# Altium schematic sheet 0169_IMVP VREG _SOC__ C.SchDoc
size 848 x 543 mm
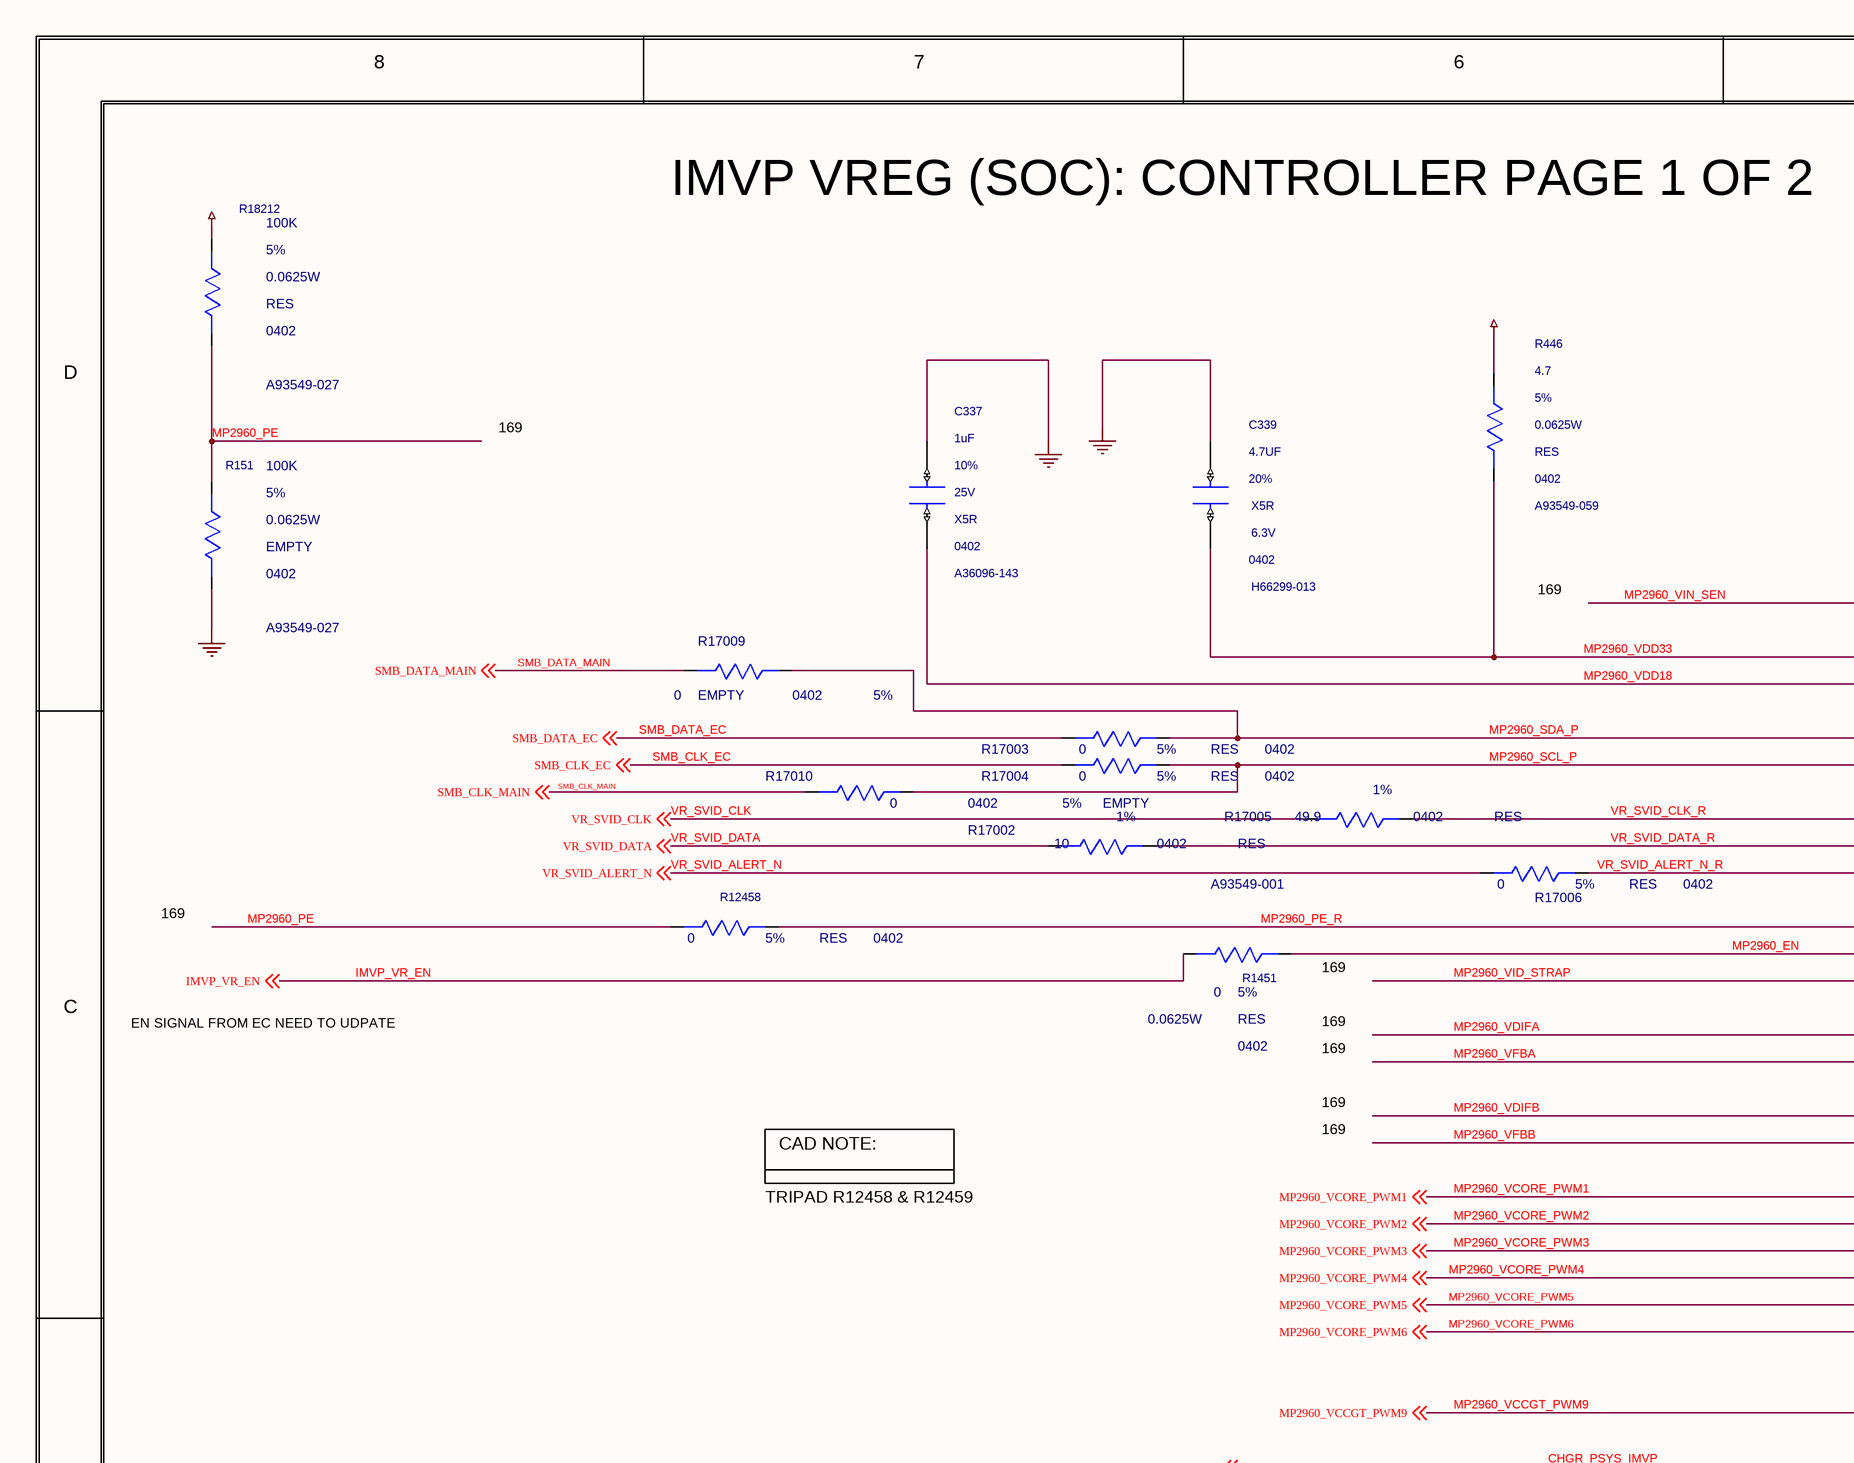
[diagram p0: 0169_IMVP VREG _SOC__ C.SchDoc, top left]
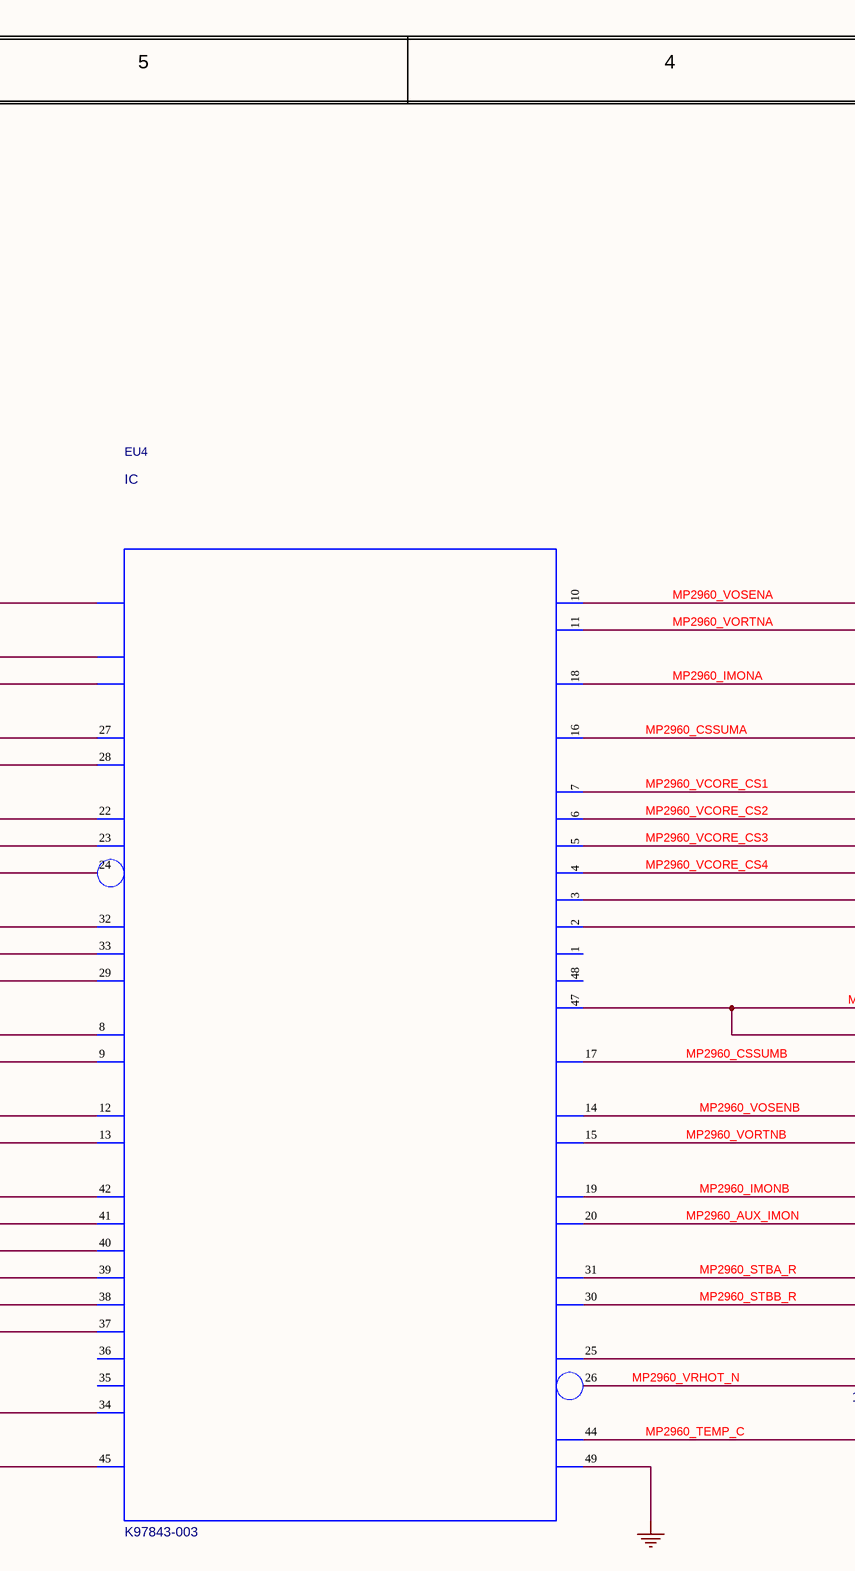
[diagram p1: 0169_IMVP VREG _SOC__ C.SchDoc, top middle]
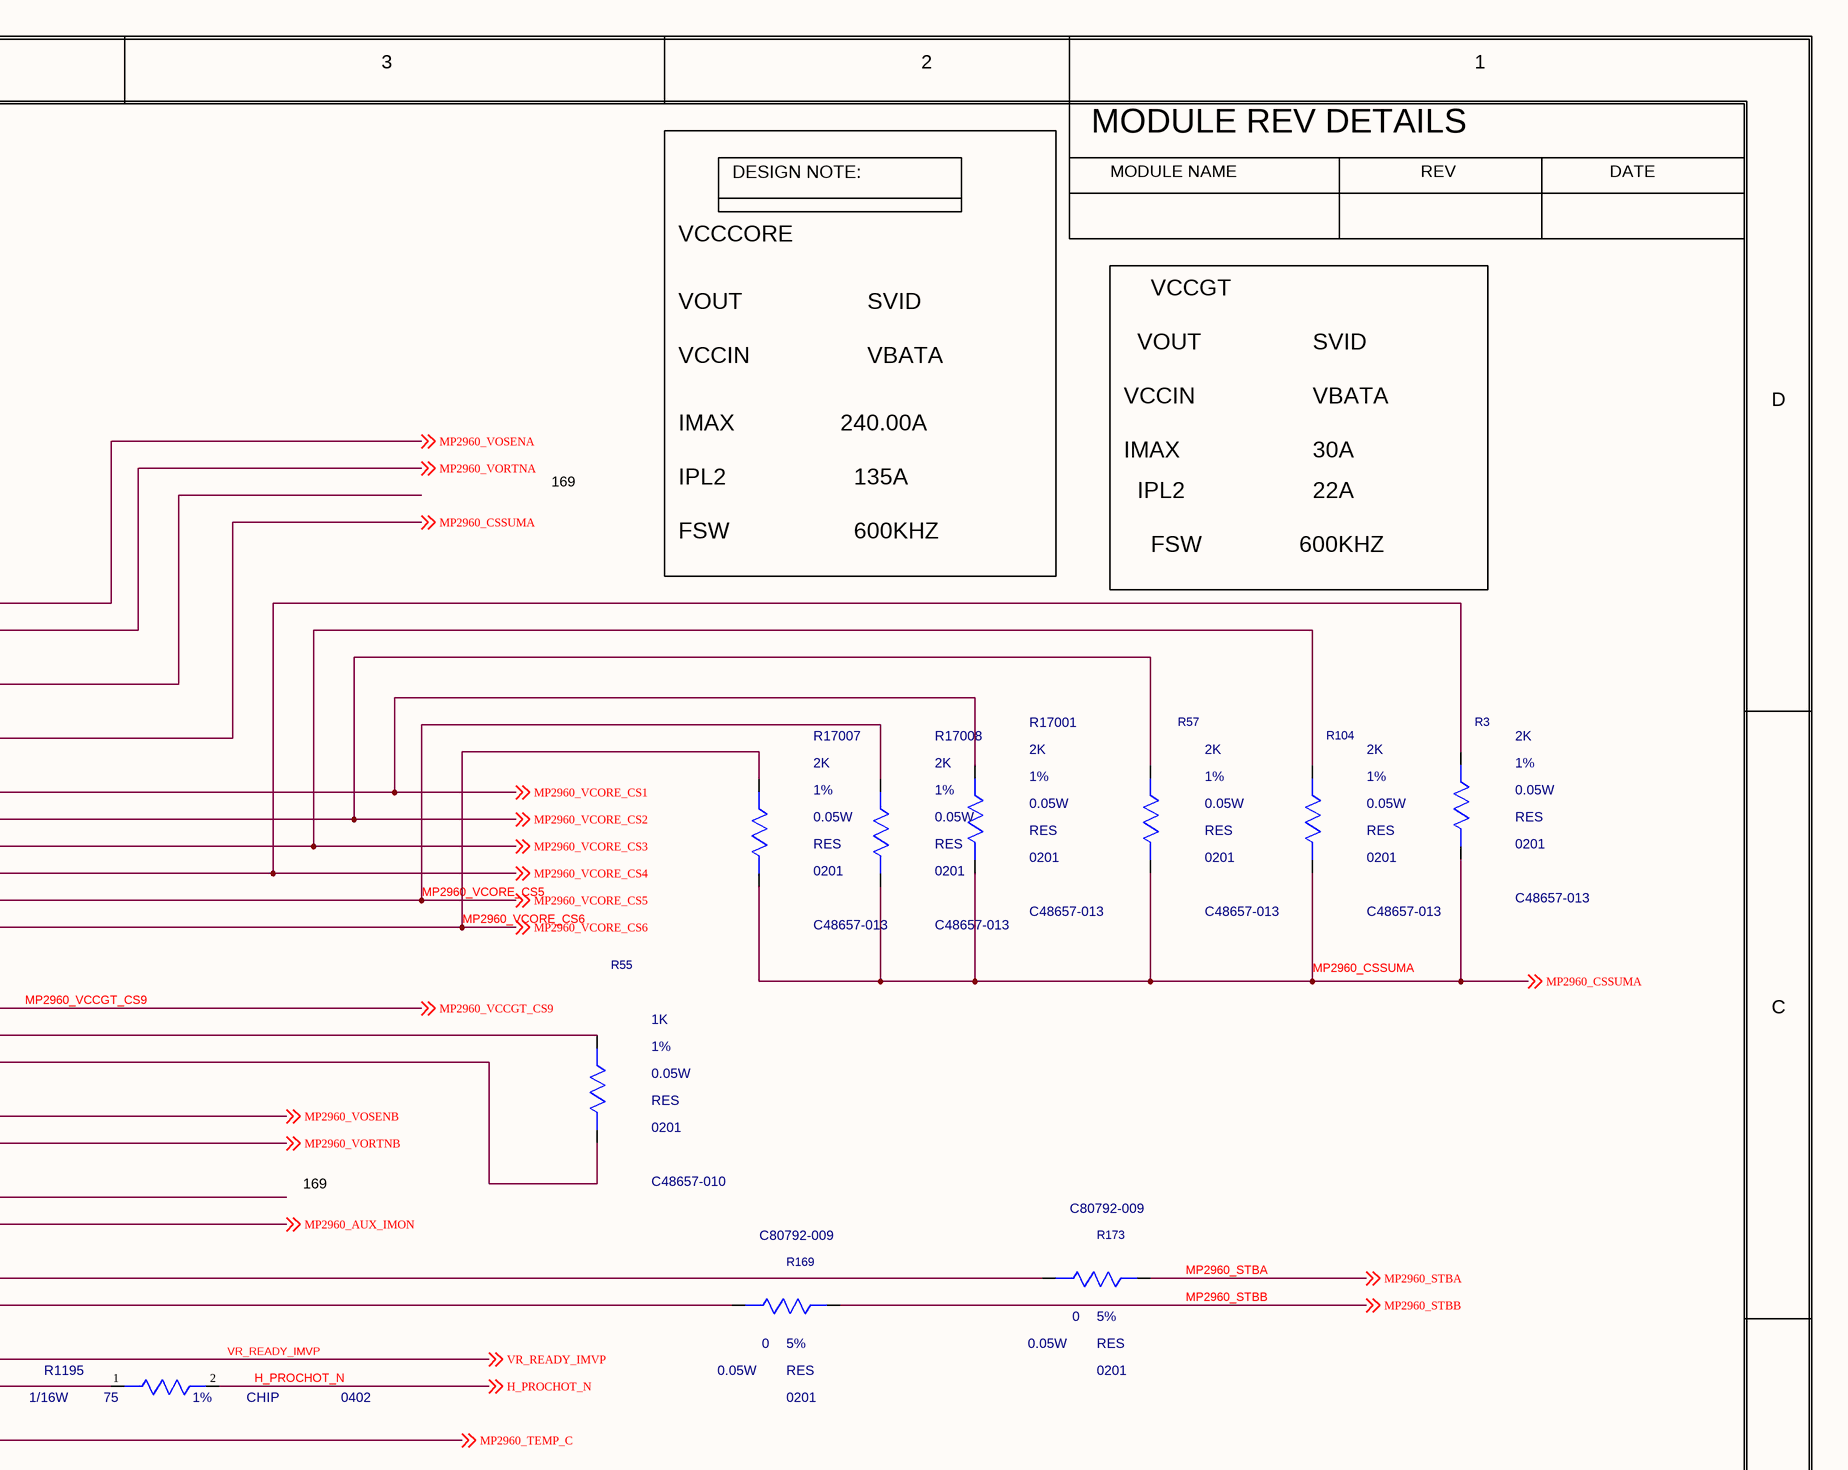
[diagram p2: 0169_IMVP VREG _SOC__ C.SchDoc, top right]
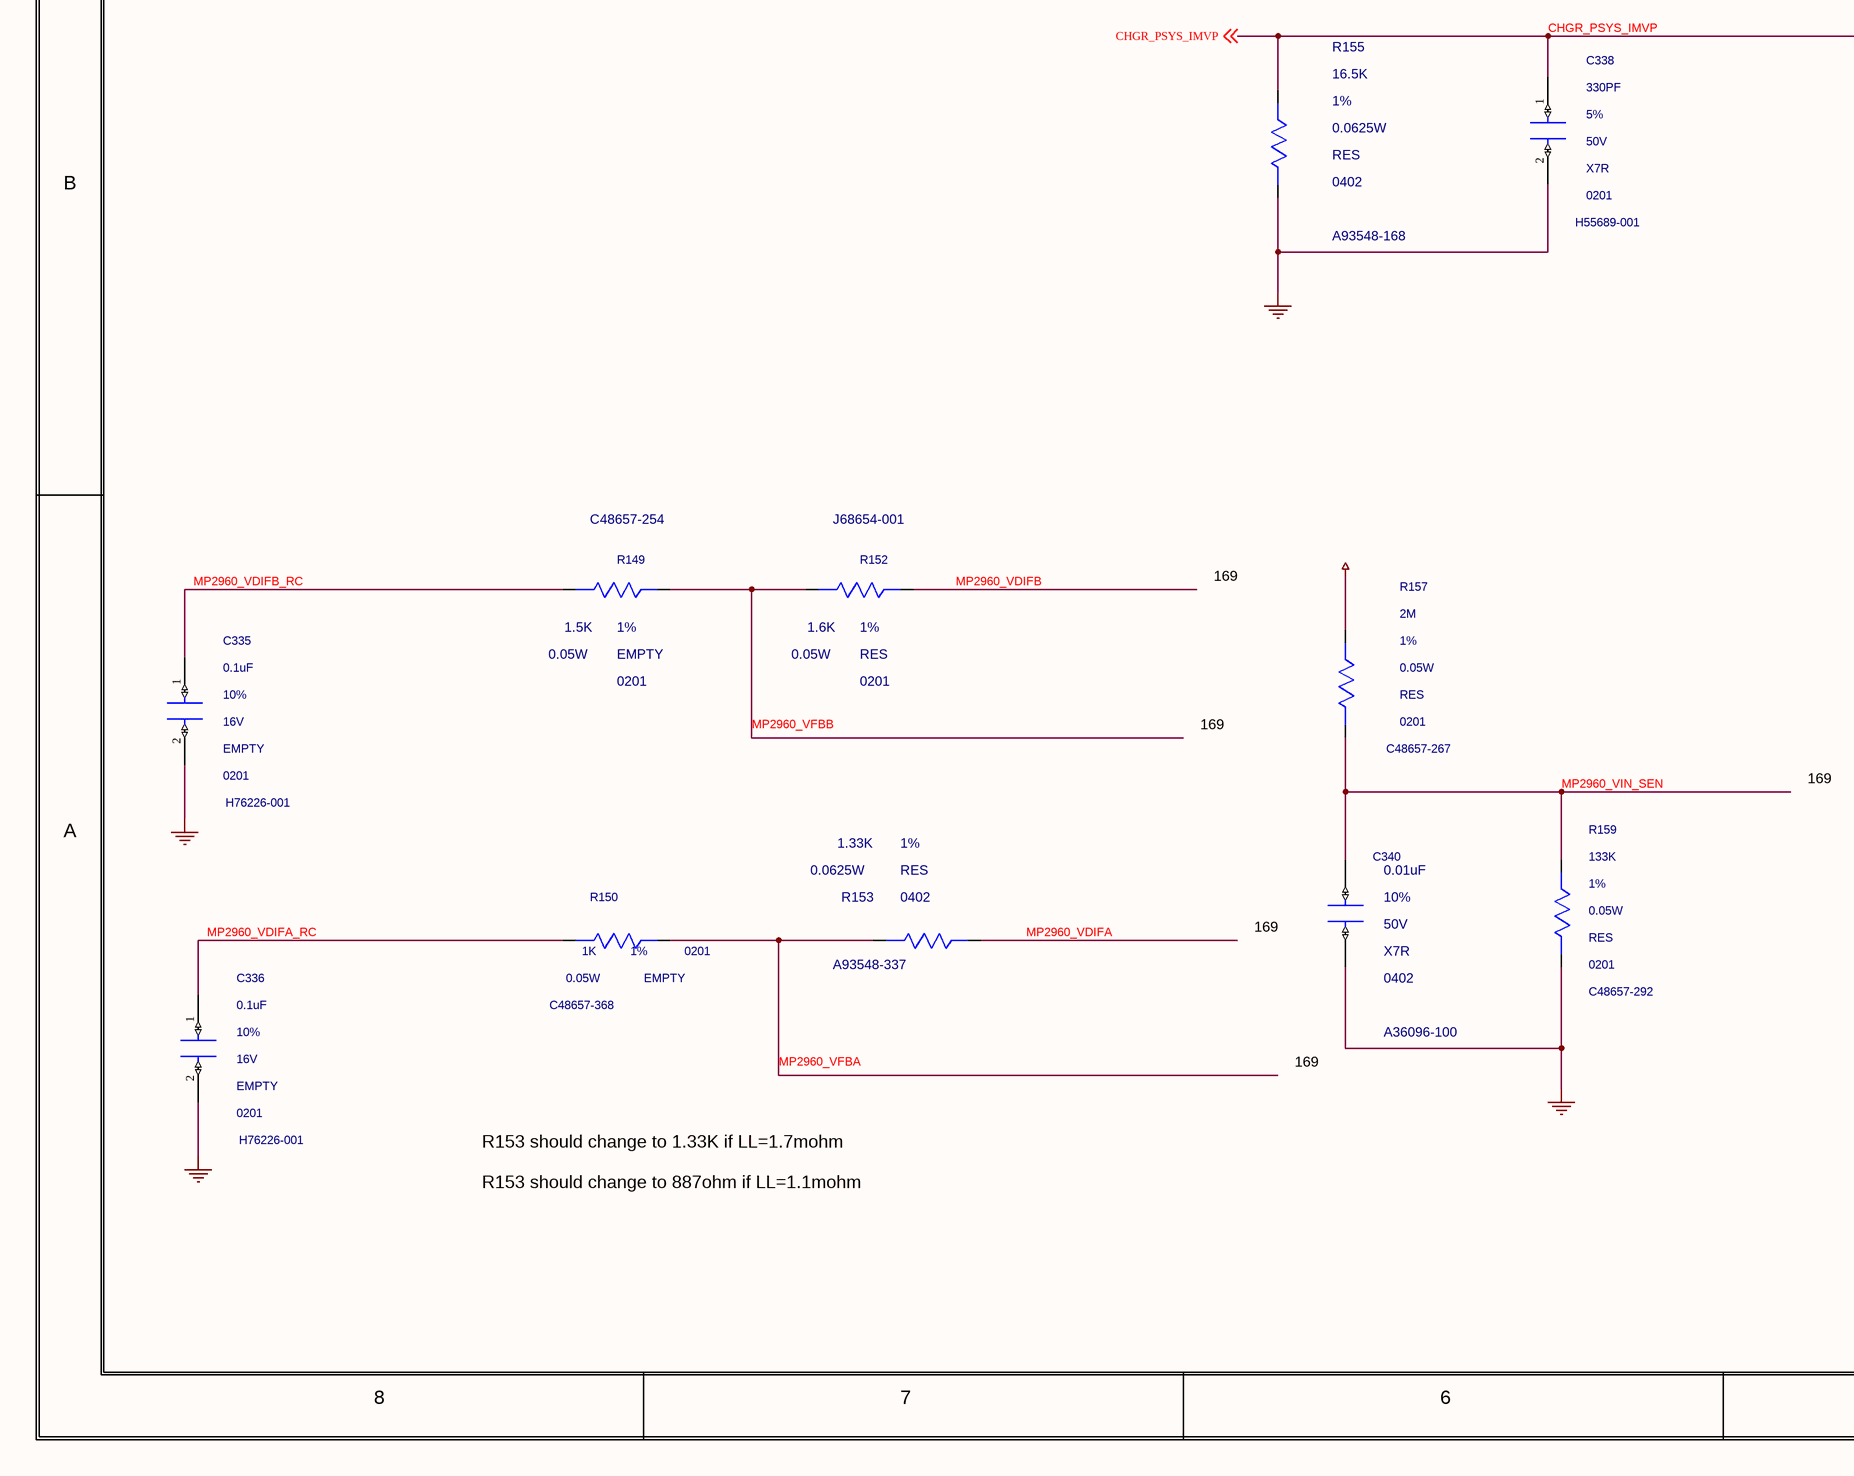
[diagram p3: 0169_IMVP VREG _SOC__ C.SchDoc, bottom left]
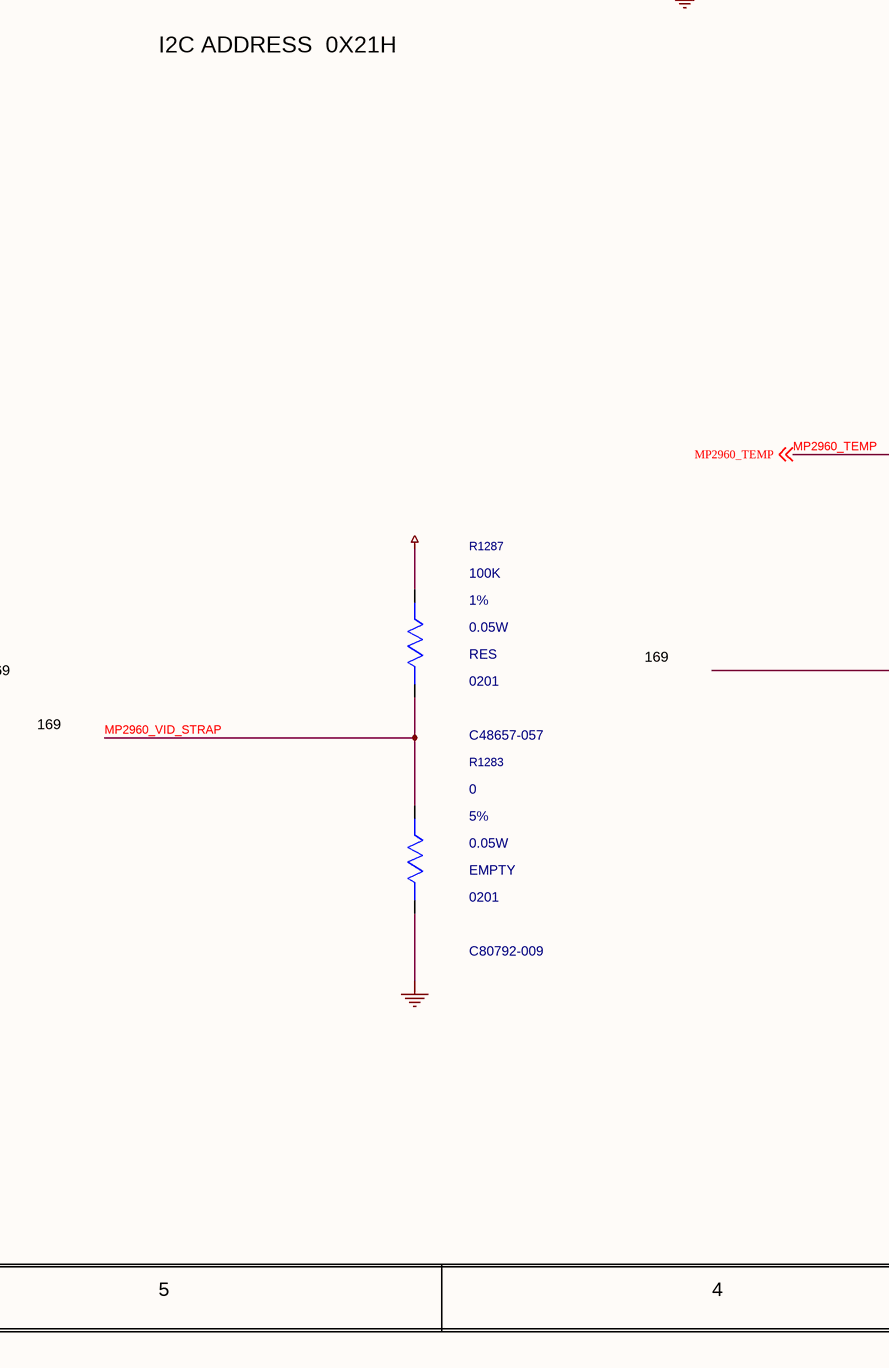
[diagram p4: 0169_IMVP VREG _SOC__ C.SchDoc, bottom middle]
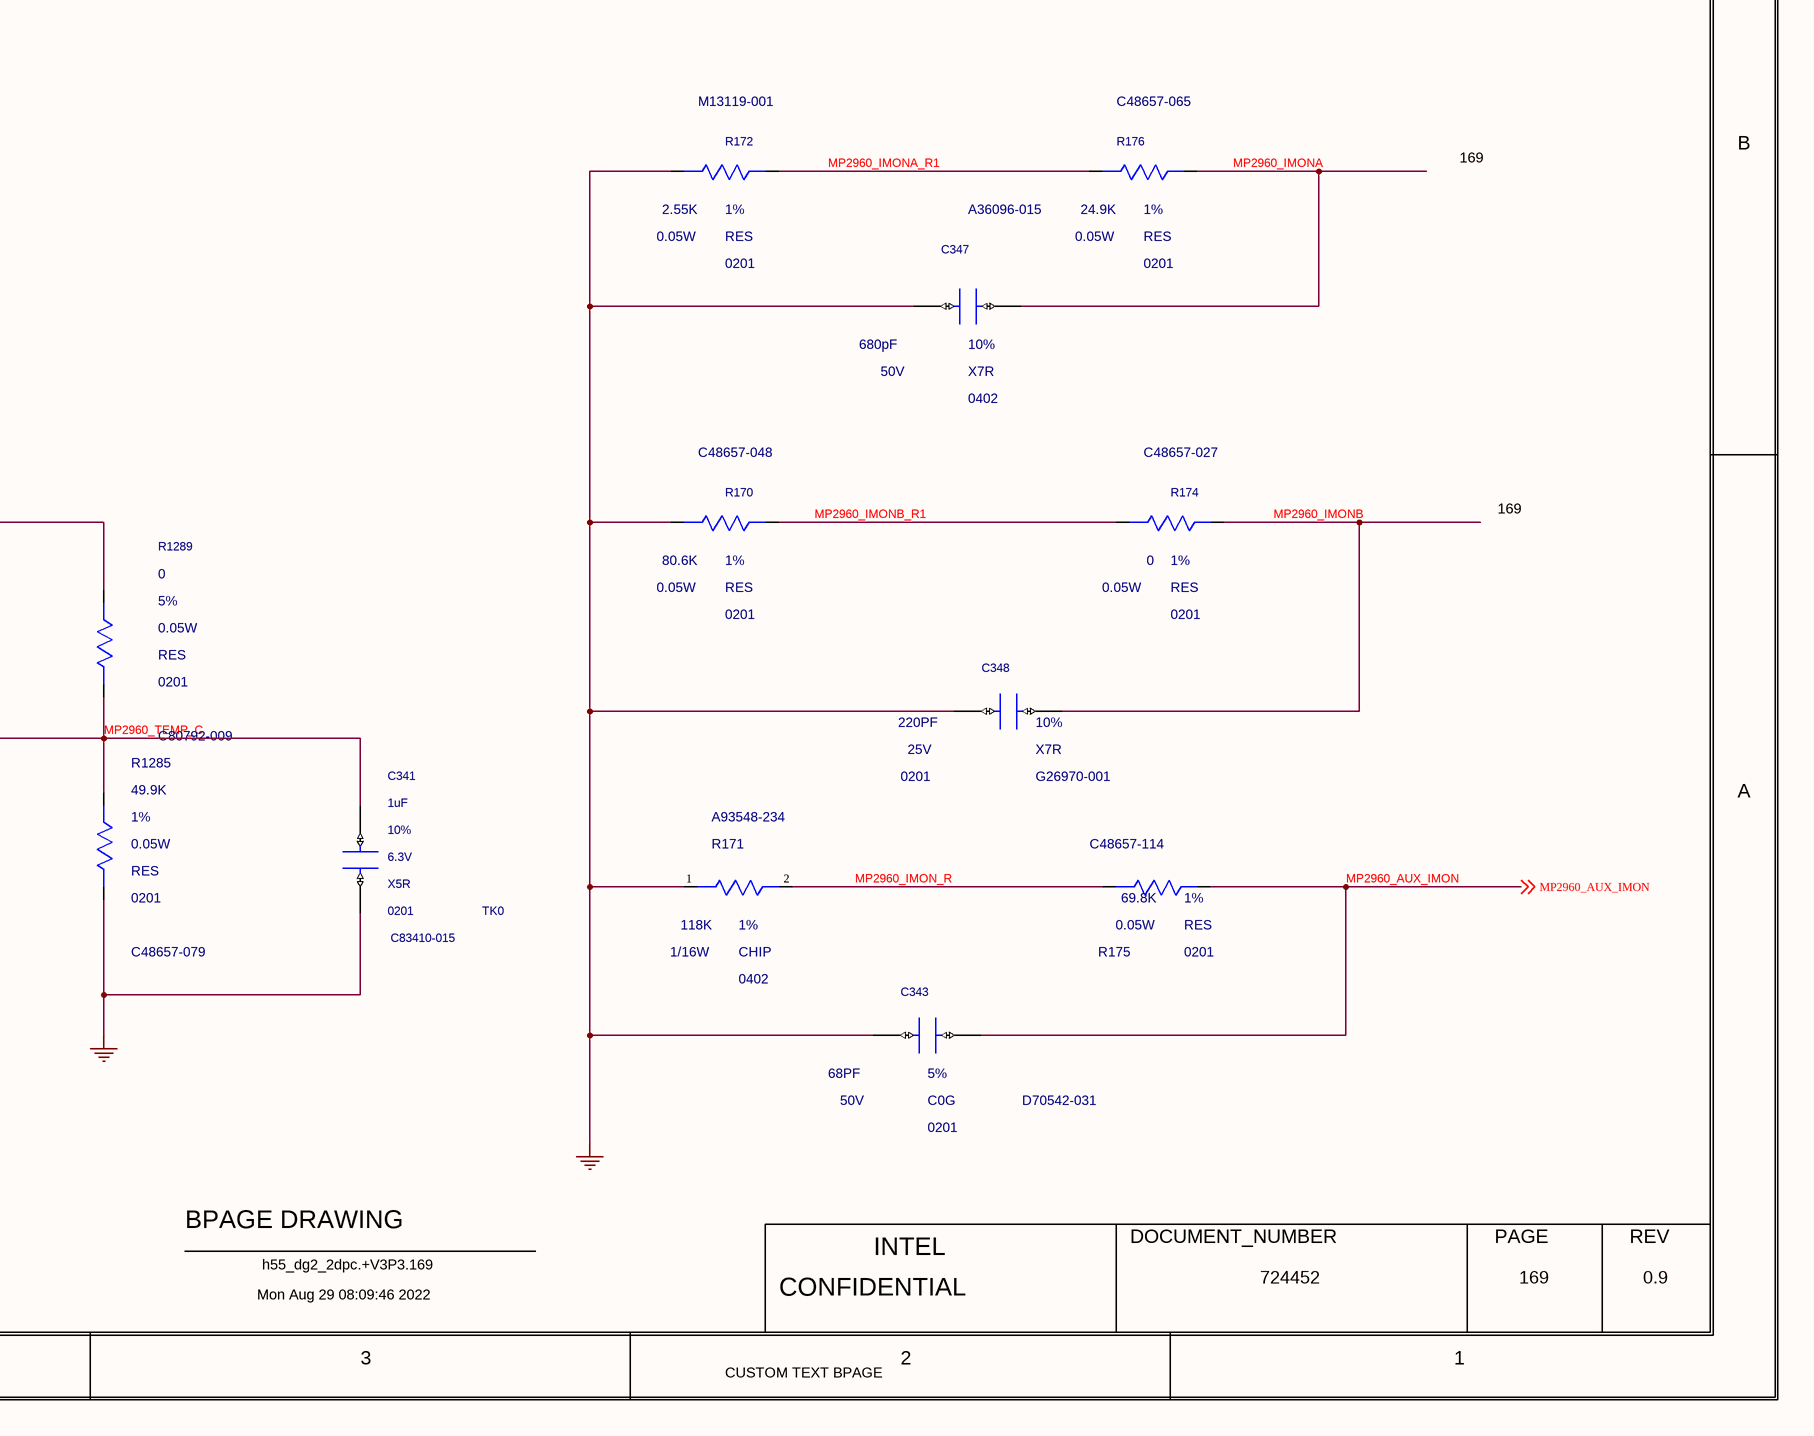
[diagram p5: 0169_IMVP VREG _SOC__ C.SchDoc, bottom right]

## Parts
C335  0.1uF  MATERIAL: EMPTY  PACK_TYPE: 0201  PART_NUMBER: H76226-001  TOLERANCE: 10%  VOLTAGE: 16V  [SMC0201MB]
C336  0.1uF  MATERIAL: EMPTY  PACK_TYPE: 0201  PART_NUMBER: H76226-001  TOLERANCE: 10%  VOLTAGE: 16V  [SMC0201MB]
C337  1uF  MATERIAL: X5R  PACK_TYPE: 0402  PART_NUMBER: A36096-143  TOLERANCE: 10%  VOLTAGE: 25V  [CTK0_SM0402_1050X550_MA]
C338  330PF  MATERIAL: X7R  PACK_TYPE: 0201  PART_NUMBER: H55689-001  TOLERANCE: 5%  VOLTAGE: 50V  [SMC0201IA]
C339  4.7UF  MATERIAL: X5R  PACK_TYPE: 0402  PART_NUMBER: H66299-013  TOLERANCE: 20%  VOLTAGE: 6.3V  [CTK0_SM0402_1200X700_MA]
C340  0.01uF  MATERIAL: X7R  PACK_TYPE: 0402  PART_NUMBER: A36096-100  TOLERANCE: 10%  VOLTAGE: 50V  [CTK2_SM0402_1050X550_MA]
C341  1uF  FP_TECH: TK0  MATERIAL: X5R  PACK_TYPE: 0201  PART_NUMBER: C83410-015  TOLERANCE: 10%  VOLTAGE: 6.3V  [CTK0_SM0201_650X350_MA]
C343  68PF  MATERIAL: C0G  PACK_TYPE: 0201  PART_NUMBER: D70542-031  TOLERANCE: 5%  VOLTAGE: 50V  [CTK2_SM0201_630X330_MA]
C347  680pF  MATERIAL: X7R  PACK_TYPE: 0402  PART_NUMBER: A36096-015  TOLERANCE: 10%  VOLTAGE: 50V  [CTK2_SM0402_1050X550_MA]
C348  220PF  MATERIAL: X7R  PACK_TYPE: 0201  PART_NUMBER: G26970-001  TOLERANCE: 10%  VOLTAGE: 25V  [CTK0_SM0201_630X330_MA]
EU4  MATERIAL: IC  PART_NUMBER: K97843-003  [CTK1_LCC48_S6100_400_DFS4650_MA]  (hidden comment: C_MP2960)
R3  2K  MATERIAL: RES  PACK_TYPE: 0201  PART_NUMBER: C48657-013  TOLERANCE: 1%  WATTAGE: 0.05W  [CTK2_SM0201_650X350_MA]
R55  1K  MATERIAL: RES  PACK_TYPE: 0201  PART_NUMBER: C48657-010  TOLERANCE: 1%  WATTAGE: 0.05W  [CTK0_SM0201_630X330_MA]
R57  2K  MATERIAL: RES  PACK_TYPE: 0201  PART_NUMBER: C48657-013  TOLERANCE: 1%  WATTAGE: 0.05W  [CTK2_SM0201_650X350_MA]
R104  2K  MATERIAL: RES  PACK_TYPE: 0201  PART_NUMBER: C48657-013  TOLERANCE: 1%  WATTAGE: 0.05W  [CTK2_SM0201_650X350_MA]
R149  1.5K  MATERIAL: EMPTY  PACK_TYPE: 0201  PART_NUMBER: C48657-254  TOLERANCE: 1%  WATTAGE: 0.05W  [CTK0_SM0201_630X330_MA]
R150  1K  MATERIAL: EMPTY  PACK_TYPE: 0201  PART_NUMBER: C48657-368  TOLERANCE: 1%  WATTAGE: 0.05W  [CTK0_SM0201_630X330_MA]
R151  100K  MATERIAL: EMPTY  PACK_TYPE: 0402  PART_NUMBER: A93549-027  TOLERANCE: 5%  WATTAGE: 0.0625W  [CTK0_SM0402_1100X550_MA]
R152  1.6K  MATERIAL: RES  PACK_TYPE: 0201  PART_NUMBER: J68654-001  TOLERANCE: 1%  WATTAGE: 0.05W  [CTK2_SM0201_630X330_MA]
R153  1.33K  MATERIAL: RES  PACK_TYPE: 0402  PART_NUMBER: A93548-337  TOLERANCE: 1%  WATTAGE: 0.0625W  [CTK2_SM0402_1100X550_MA]
R155  16.5K  MATERIAL: RES  PACK_TYPE: 0402  PART_NUMBER: A93548-168  TOLERANCE: 1%  WATTAGE: 0.0625W  [CTK2_SM0402_1100X550_MA]
R157  2M  MATERIAL: RES  PACK_TYPE: 0201  PART_NUMBER: C48657-267  TOLERANCE: 1%  WATTAGE: 0.05W  [CTK0_SM0201_630X330_MA]
R159  133K  MATERIAL: RES  PACK_TYPE: 0201  PART_NUMBER: C48657-292  TOLERANCE: 1%  WATTAGE: 0.05W  [CTK0_SM0201_630X330_MA]
R169  0  MATERIAL: RES  PACK_TYPE: 0201  PART_NUMBER: C80792-009  TOLERANCE: 5%  WATTAGE: 0.05W  [CTK2_SM0201_630X330_MA]
R170  80.6K  MATERIAL: RES  PACK_TYPE: 0201  PART_NUMBER: C48657-048  TOLERANCE: 1%  WATTAGE: 0.05W  [CTK2_SM0201_630X330_MA]
R171  118K  MATERIAL: CHIP  PACK_TYPE: 0402  PART_NUMBER: A93548-234  TOLERANCE: 1%  WATTAGE: 1/16W  [SMR0402IA]
R172  2.55K  MATERIAL: RES  PACK_TYPE: 0201  PART_NUMBER: M13119-001  TOLERANCE: 1%  WATTAGE: 0.05W  [CTK2_SM0201_650X350_MA]
R173  0  MATERIAL: RES  PACK_TYPE: 0201  PART_NUMBER: C80792-009  TOLERANCE: 5%  WATTAGE: 0.05W  [CTK2_SM0201_630X330_MA]
R174  0  MATERIAL: RES  PACK_TYPE: 0201  PART_NUMBER: C48657-027  TOLERANCE: 1%  WATTAGE: 0.05W  [CTK2_SM0201_630X330_MA]
R175  69.8K  MATERIAL: RES  PACK_TYPE: 0201  PART_NUMBER: C48657-114  TOLERANCE: 1%  WATTAGE: 0.05W  [CTK2_SM0201_630X330_MA]
R176  24.9K  MATERIAL: RES  PACK_TYPE: 0201  PART_NUMBER: C48657-065  TOLERANCE: 1%  WATTAGE: 0.05W  [CTK2_SM0201_630X330_MA]
R446  4.7  MATERIAL: RES  PACK_TYPE: 0402  PART_NUMBER: A93549-059  TOLERANCE: 5%  WATTAGE: 0.0625W  [CTK0_SM0402_1100X550_MA]
R1195  75  MATERIAL: CHIP  PACK_TYPE: 0402  TOLERANCE: 1%  WATTAGE: 1/16W  [SMR0402IA]
R1283  0  MATERIAL: EMPTY  PACK_TYPE: 0201  PART_NUMBER: C80792-009  TOLERANCE: 5%  WATTAGE: 0.05W  [CTK0_SM0201_630X330_MA]
R1285  49.9K  MATERIAL: RES  PACK_TYPE: 0201  PART_NUMBER: C48657-079  TOLERANCE: 1%  WATTAGE: 0.05W  [CTK2_SM0201_650X350_MA]
R1287  100K  MATERIAL: RES  PACK_TYPE: 0201  PART_NUMBER: C48657-057  TOLERANCE: 1%  WATTAGE: 0.05W  [CTK0_SM0201_630X330_MA]
R1289  0  MATERIAL: RES  PACK_TYPE: 0201  PART_NUMBER: C80792-009  TOLERANCE: 5%  WATTAGE: 0.05W  [CTK2_SM0201_630X330_MA]
R1451  0  MATERIAL: RES  PACK_TYPE: 0402  PART_NUMBER: A93549-001  TOLERANCE: 5%  WATTAGE: 0.0625W  [CTK0_SM0402_1100X550_MA]
R12458  0  MATERIAL: RES  PACK_TYPE: 0402  TOLERANCE: 5%  [CTK0_SM0402_1100X550_MA]
R17001  2K  MATERIAL: RES  PACK_TYPE: 0201  PART_NUMBER: C48657-013  TOLERANCE: 1%  WATTAGE: 0.05W  [CTK2_SM0201_650X350_MA]
R17002  10  MATERIAL: RES  PACK_TYPE: 0402  TOLERANCE: 1%  [CTK2_SM0402_1100X550_MA]
R17003  0  MATERIAL: RES  PACK_TYPE: 0402  TOLERANCE: 5%  [CTK0_SM0402_1100X550_MA]
R17004  0  MATERIAL: RES  PACK_TYPE: 0402  TOLERANCE: 5%  [CTK0_SM0402_1100X550_MA]
R17005  49.9  MATERIAL: RES  PACK_TYPE: 0402  TOLERANCE: 1%  [CTK2_SM0402_1100X550_MA]
R17006  0  MATERIAL: RES  PACK_TYPE: 0402  TOLERANCE: 5%  [CTK0_SM0402_1100X550_MA]
R17007  2K  MATERIAL: RES  PACK_TYPE: 0201  PART_NUMBER: C48657-013  TOLERANCE: 1%  WATTAGE: 0.05W  [CTK2_SM0201_650X350_MA]
R17008  2K  MATERIAL: RES  PACK_TYPE: 0201  PART_NUMBER: C48657-013  TOLERANCE: 1%  WATTAGE: 0.05W  [CTK2_SM0201_650X350_MA]
R17009  0  MATERIAL: EMPTY  PACK_TYPE: 0402  TOLERANCE: 5%  [CTK0_SM0402_1100X550_MA]
R17010  0  MATERIAL: EMPTY  PACK_TYPE: 0402  TOLERANCE: 5%  [CTK0_SM0402_1100X550_MA]
R18212  100K  MATERIAL: RES  PACK_TYPE: 0402  PART_NUMBER: A93549-027  TOLERANCE: 5%  WATTAGE: 0.0625W  [CTK0_SM0402_1100X550_MA]

## Nets
+V3P3A: R446.1(A) R1287.1(A) R18212.1(A)
+VBATA_VCCIN: R157.1(A)
GND: C335.2(B) C336.2(B) C337.1(A) C338.2(B) C339.1(A) C340.2(B) C341.2(B) C343.1(A) C347.1(A) C348.1(A) EU4.49(AGND_TPD) R151.2(B) R155.2(B) R159.2(B) R170.1(A) R171.1(A) R172.1(A) R1283.2(B) R1285.2(B)
VDD18: EU4.21(VDD18)
VDD33: EU4.43(VDD33)
VIN_SEN_VSYS: EU4.46(VIN_SEN_VSYS)
CHGR_PSYS_IMVP: C338.1(A) EU4.45(PSYS) R155.1(A) ; off-sheet CHGR_PSYS_IMVP
H_PROCHOT_N: R1195.2(B) ; off-sheet H_PROCHOT_N
IMVP_VR_EN: R1451.1(A) ; off-sheet IMVP_VR_EN
MP2960_AUX_IMON: C343.2(B) EU4.20(AUX_IMON) R175.2(B) ; off-sheet MP2960_AUX_IMON
MP2960_CSSUMA: EU4.16(CSSUMA) R3.2(B) R57.2(B) R104.2(B) R17001.2(B) R17007.2(B) R17008.2(B) ; off-sheet MP2960_CSSUMA
MP2960_CSSUMB: EU4.17(CSSUMB) R55.2(B)
MP2960_EN: EU4.33(EN) R1451.2(B)
MP2960_IMON_R: R171.2(B) R175.1(A)
MP2960_IMONA: C347.2(B) EU4.18(IMONA) R176.2(B)
MP2960_IMONA_R1: R172.2(B) R176.1(A)
MP2960_IMONB: C348.2(B) EU4.19(IMONB) R174.2(B)
MP2960_IMONB_R1: R170.2(B) R174.1(A)
MP2960_PE: R151.1(A) R12458.1(A) R18212.2(B)
MP2960_PE_R: EU4.32(PE) R12458.2(B)
MP2960_SCL_P: EU4.28(SCL_P) R17004.2(B) R17010.2(B)
MP2960_SDA_P: EU4.27(SDA_P) R17003.2(B) R17009.2(B)
MP2960_STBA: R173.2(B) ; off-sheet MP2960_STBA
MP2960_STBA_R: EU4.31(STBA) R173.1(A)
MP2960_STBB: R169.2(B) ; off-sheet MP2960_STBB
MP2960_STBB_R: EU4.30(STBB) R169.1(A)
MP2960_TEMP: R1289.1(A) ; off-sheet MP2960_TEMP
MP2960_TEMP_C: C341.1(A) EU4.44(TEMP) R1285.1(A) R1289.2(B) ; off-sheet MP2960_TEMP_C
MP2960_VCCGT_CS9: EU4.47(CS9) R55.1(A) ; off-sheet MP2960_VCCGT_CS9
MP2960_VCCGT_PWM9: EU4.34(PWM9) ; off-sheet MP2960_VCCGT_PWM9
MP2960_VCORE_CS1: EU4.7(CS1) R17001.1(A) ; off-sheet MP2960_VCORE_CS1
MP2960_VCORE_CS2: EU4.6(CS2) R57.1(A) ; off-sheet MP2960_VCORE_CS2
MP2960_VCORE_CS3: EU4.5(CS3) R104.1(A) ; off-sheet MP2960_VCORE_CS3
MP2960_VCORE_CS4: EU4.4(CS4) R3.1(A) ; off-sheet MP2960_VCORE_CS4
MP2960_VCORE_CS5: EU4.3(CS5) R17008.1(A) ; off-sheet MP2960_VCORE_CS5
MP2960_VCORE_CS6: EU4.2(CS6) R17007.1(A) ; off-sheet MP2960_VCORE_CS6
MP2960_VCORE_PWM1: EU4.42(PWM1) ; off-sheet MP2960_VCORE_PWM1
MP2960_VCORE_PWM2: EU4.41(PWM2) ; off-sheet MP2960_VCORE_PWM2
MP2960_VCORE_PWM3: EU4.40(PWM3) ; off-sheet MP2960_VCORE_PWM3
MP2960_VCORE_PWM4: EU4.39(PWM4) ; off-sheet MP2960_VCORE_PWM4
MP2960_VCORE_PWM5: EU4.38(PWM5) ; off-sheet MP2960_VCORE_PWM5
MP2960_VCORE_PWM6: EU4.37(PWM6) ; off-sheet MP2960_VCORE_PWM6
MP2960_VDD18: C337.2(B)
MP2960_VDD33: C339.2(B) R446.2(B)
MP2960_VDIFA: EU4.8(VDIFFA) R153.2(B)
MP2960_VDIFA_RC: C336.1(A) R150.1(A)
MP2960_VDIFB: EU4.12(VDIFFB) R152.2(B)
MP2960_VDIFB_RC: C335.1(A) R149.1(A)
MP2960_VFBA: EU4.9(VFBA) R150.2(B) R153.1(A)
MP2960_VFBB: EU4.13(VFBB) R149.2(B) R152.1(A)
MP2960_VID_STRAP: EU4.29(VID_STRAP) R1283.1(A) R1287.2(B)
MP2960_VIN_SEN: C340.1(A) R157.2(B) R159.1(A)
MP2960_VORTNA: EU4.11(VORTNA) ; off-sheet MP2960_VORTNA
MP2960_VORTNB: EU4.15(VORTNB) ; off-sheet MP2960_VORTNB
MP2960_VOSENA: EU4.10(VOSENA) ; off-sheet MP2960_VOSENA
MP2960_VOSENB: EU4.14(VOSENB) ; off-sheet MP2960_VOSENB
MP2960_VRHOT_N: EU4.26(VRHOT_N) R1195.1(A)
SMB_CLK_EC: R17004.1(A) ; off-sheet SMB_CLK_EC
SMB_CLK_MAIN: R17010.1(A) ; off-sheet SMB_CLK_MAIN
SMB_DATA_EC: R17003.1(A) ; off-sheet SMB_DATA_EC
SMB_DATA_MAIN: R17009.1(A) ; off-sheet SMB_DATA_MAIN
VR_READY_IMVP: EU4.25(VRRDY) ; off-sheet VR_READY_IMVP
VR_SVID_ALERT_N: R17006.1(A) ; off-sheet VR_SVID_ALERT_N
VR_SVID_ALERT_N_R: EU4.24(ALT_N) R17006.2(B)
VR_SVID_CLK: R17005.1(A) ; off-sheet VR_SVID_CLK
VR_SVID_CLK_R: EU4.22(SCLK) R17005.2(B)
VR_SVID_DATA: R17002.1(A) ; off-sheet VR_SVID_DATA
VR_SVID_DATA_R: EU4.23(SDIO) R17002.2(B)

Not connected (* = marked no-connect by the designer): EU4 1(CS7) 35(PWM8) 36(PWM7) 48(CS8)

## Notes on the sheet
- 8
- 7
- 6
- 5
- 4
- 3
- 2
- 1
- MODULE REV DETAILS
- IMVP VREG (SOC): CONTROLLER PAGE 1 OF 2
- DESIGN NOTE:
- MODULE NAME
- REV
- DATE
- VCCCORE
- VCCGT
- VOUT
- VCCIN
- SVID
- VBATA
- D
- 169
- IMAX
- 240.00A
- IPL2
- 135A
- 22A
- 30A
- FSW
- 600KHZ
- (near R1451) 169
- C
- EN SIGNAL FROM EC NEED TO UDPATE
- CAD NOTE:
- TRIPAD R12458 & R12459
- B
- I2C ADDRESS  0X21H
- A
- R153 should change to 1.33K if LL=1.7mohm
- R153 should change to 887ohm if LL=1.1mohm
- BPAGE DRAWING
- INTEL
- DOCUMENT_NUMBER
- PAGE
- Mon Aug 29 08:09:46 2022
- h55_dg2_2dpc.+V3P3.169
- CONFIDENTIAL
- 724452
- 0.9
- CUSTOM TEXT BPAGE

## Library data of the parts
C335 = CAP: CDS_PHYS_PART_NAME: CAP_0201-H76226-001,EMPTY,0.1UF,16V,10%,LPDB,GENERIC; OriginalSymbolOrigin: (-50,25); XY: (-3125,875); VER: 1; ROT: 0; PHYS_PAGE: 169; LOCATION: C335; DRAWING: @RVP1_ADL_SB_ADP_S_DDR5_SODIMM_2DPC_LIB.H55_DG2_2DPC(SCH_1):PAGE538; CDS_LIB: discrete; PCB Footprint: SMC0201MB; CHIPS_PART_NAME: CAP; CDS_PART_NAME: CAP_0201-H76226-001,EMPTY,0.1UF,16V,10%,LPDB,GENERIC; CDS_LOCATION: C335
C336 = CAP: CDS_PHYS_PART_NAME: CAP_0201-H76226-001,EMPTY,0.1UF,16V,10%,LPDB,GENERIC; OriginalSymbolOrigin: (-50,25); XY: (-3100,250); VER: 1; ROT: 0; PHYS_PAGE: 169; LOCATION: C336; DRAWING: @RVP1_ADL_SB_ADP_S_DDR5_SODIMM_2DPC_LIB.H55_DG2_2DPC(SCH_1):PAGE538; CDS_LIB: discrete; PCB Footprint: SMC0201MB; CHIPS_PART_NAME: CAP; CDS_PART_NAME: CAP_0201-H76226-001,EMPTY,0.1UF,16V,10%,LPDB,GENERIC; CDS_LOCATION: C336
C337 = C_CAP: CDS_PHYS_PART_NAME: C_CAP_0402-A36096-143,X5R,1UF,25V,10%,TK0,GENERIC; CDS_LMAN_SYM_OUTLINE: -50,50,50,-50; FP_TECH: TK0; IP: GENERIC; ROOM: NONE; OriginalSymbolOrigin: (-50,25); XY: (-1750,3925); VER: 1; SUB_ROOM: GPU_VCCIN; ROT: 0; PHYS_PAGE: 169; LOCATION: C337; DRAWING: @RVP1_ADL_SB_ADP_S_DDR5_SODIMM_2DPC_LIB.H55_DG2_2DPC(SCH_1):PAGE538; CDS_LIB: c_discrete; VARIANT: ?; PCB Footprint: CTK0_SM0402_1050X550_MA; CHIPS_PART_NAME: C_CAP; CDS_PART_NAME: C_CAP_0402-A36096-143,X5R,1UF,25V,10%,TK0,GENERIC; CDS_LOCATION: C337
C338 = CAP: CDS_PHYS_PART_NAME: CAP_0201-H55689-001,X7R,330PF,50V,5%,LPDB,GENERIC; OriginalSymbolOrigin: (-50,25); XY: (-600,1950); VER: 1; ROT: 0; PHYS_PAGE: 169; LOCATION: C338; DRAWING: @RVP1_ADL_SB_ADP_S_DDR5_SODIMM_2DPC_LIB.H55_DG2_2DPC(SCH_1):PAGE538; CDS_LIB: discrete; PCB Footprint: SMC0201IA; CHIPS_PART_NAME: CAP; CDS_PART_NAME: CAP_0201-H55689-001,X7R,330PF,50V,5%,LPDB,GENERIC; CDS_LOCATION: C338
C339 = C_CAP: CDS_PHYS_PART_NAME: C_CAP_0402-H66299-013,X5R,4.7UF,6.3V,20%,TK0,GENERIC; CDS_LMAN_SYM_OUTLINE: -50,50,50,-50; FP_TECH: TK0; IP: GENERIC; ROOM: NONE; OriginalSymbolOrigin: (-50,25); XY: (-1225,3925); VER: 1; ROT: 0; PHYS_PAGE: 169; LOCATION: C339; DRAWING: @RVP1_ADL_SB_ADP_S_DDR5_SODIMM_2DPC_LIB.H55_DG2_2DPC(SCH_1):PAGE538; CDS_LIB: c_discrete; VARIANT: ?; PCB Footprint: CTK0_SM0402_1200X700_MA; CHIPS_PART_NAME: C_CAP; CDS_PART_NAME: C_CAP_0402-H66299-013,X5R,4.7UF,6.3V,20%,TK0,GENERIC; CDS_LOCATION: C339
C340 = C_CAP: CDS_PHYS_PART_NAME: C_CAP_0402-A36096-100,X7R,0.01UF,50V,10%,TK2,GENERIC; CDS_LMAN_SYM_OUTLINE: -50,50,50,-50; FP_TECH: TK2; IP: GENERIC; ROOM: NONE; OriginalSymbolOrigin: (-50,25); XY: (-975,500); VER: 1; ROT: 0; PHYS_PAGE: 169; LOCATION: C340; DRAWING: @RVP1_ADL_SB_ADP_S_DDR5_SODIMM_2DPC_LIB.H55_DG2_2DPC(SCH_1):PAGE538; CDS_LIB: c_discrete; VARIANT: ?; PCB Footprint: CTK2_SM0402_1050X550_MA; CHIPS_PART_NAME: C_CAP; CDS_PART_NAME: C_CAP_0402-A36096-100,X7R,0.01UF,50V,10%,TK2,GENERIC; CDS_LOCATION: C340
C341 = C_CAP: CDS_PHYS_PART_NAME: C_CAP_0201-C83410-015,X5R,1UF,6.3V,10%,TK0,GENERIC; CDS_LMAN_SYM_OUTLINE: -50,50,50,-50; IP: GENERIC; ROOM: NONE; OriginalSymbolOrigin: (-50,25); XY: (2225,525); VER: 1; ROT: 0; PHYS_PAGE: 169; LOCATION: C341; DRAWING: @RVP1_ADL_SB_ADP_S_DDR5_SODIMM_2DPC_LIB.H55_DG2_2DPC(SCH_1):PAGE538; CDS_LIB: c_discrete; VARIANT: ?; PCB Footprint: CTK0_SM0201_650X350_MA; CHIPS_PART_NAME: C_CAP; CDS_PART_NAME: C_CAP_0201-C83410-015,X5R,1UF,6.3V,10%,TK0,GENERIC; CDS_LOCATION: C341
C343 = C_CAP#1: CHIPS_PART_NAME: C_CAP; CDS_PHYS_PART_NAME: C_CAP_0201-D70542-031,C0G,68PF,50V,5%,TK2,GENERIC; CDS_LMAN_SYM_OUTLINE: -50,50,50,-50; FP_TECH: TK2; IP: GENERIC; ROOM: NONE; OriginalSymbolOrigin: (-25,50); XY: (3275,200); VER: 2; ROT: 0; PHYS_PAGE: 169; LOCATION: C343; DRAWING: @RVP1_ADL_SB_ADP_S_DDR5_SODIMM_2DPC_LIB.H55_DG2_2DPC(SCH_1):PAGE538; CDS_LIB: c_discrete; VARIANT: ?; PCB Footprint: CTK2_SM0201_630X330_MA; CDS_PART_NAME: C_CAP_0201-D70542-031,C0G,68PF,50V,5%,TK2,GENERIC; CDS_LOCATION: C343
C347 = C_CAP#1: CHIPS_PART_NAME: C_CAP; CDS_PHYS_PART_NAME: C_CAP_0402-A36096-015,X7R,680PF,50V,10%,TK2,GENERIC; CDS_LMAN_SYM_OUTLINE: -50,50,50,-50; FP_TECH: TK2; IP: GENERIC; ROOM: NONE; OriginalSymbolOrigin: (-25,50); XY: (3350,1550); VER: 2; ROT: 0; PHYS_PAGE: 169; LOCATION: C347; DRAWING: @RVP1_ADL_SB_ADP_S_DDR5_SODIMM_2DPC_LIB.H55_DG2_2DPC(SCH_1):PAGE538; CDS_LIB: c_discrete; VARIANT: ?; PCB Footprint: CTK2_SM0402_1050X550_MA; CDS_PART_NAME: C_CAP_0402-A36096-015,X7R,680PF,50V,10%,TK2,GENERIC; CDS_LOCATION: C347
C348 = C_CAP#1: CHIPS_PART_NAME: C_CAP; CDS_PHYS_PART_NAME: C_CAP_0201-G26970-001,X7R,220PF,25V,10%,TK0,GENERIC; CDS_LMAN_SYM_OUTLINE: -50,50,50,-50; FP_TECH: TK0; IP: GENERIC; ROOM: NONE; OriginalSymbolOrigin: (-25,50); XY: (3425,800); VER: 2; ROT: 0; PHYS_PAGE: 169; LOCATION: C348; DRAWING: @RVP1_ADL_SB_ADP_S_DDR5_SODIMM_2DPC_LIB.H55_DG2_2DPC(SCH_1):PAGE538; CDS_LIB: c_discrete; VARIANT: ?; PCB Footprint: CTK0_SM0201_630X330_MA; CDS_PART_NAME: C_CAP_0201-G26970-001,X7R,220PF,25V,10%,TK0,GENERIC; CDS_LOCATION: C348
EU4 = C_MP2960: CDS_PHYS_PART_NAME: C_MP2960_LCC-K97843-003,IC,MP2960RGQKT-0011,TK1,GENERIC; CDS_LMAN_SYM_OUTLINE: -400,900,400,-900; FP_TECH: TK1; IP: GENERIC; PACK_TYPE: LCC; ROOM: NONE; OriginalSymbolOrigin: (-450,900); XY: (600,2925); VER: 1; ROT: 0; PHYS_PAGE: 169; LOCATION: EU4; DRAWING: @RVP1_ADL_SB_ADP_S_DDR5_SODIMM_2DPC_LIB.H55_DG2_2DPC(SCH_1):PAGE538; CDS_LIB: local; VARIANT: ?; PCB Footprint: CTK1_LCC48_S6100_400_DFS4650_MA; SEC_TYPE: LCC; CHIPS_PART_NAME: C_MP2960; CDS_PART_NAME: C_MP2960_LCC-K97843-003,IC,MP2960RGQKT-0011,TK1,GENERIC; CDS_LOCATION: EU4
R3 = C_RES: CDS_PHYS_PART_NAME: C_RES_0201-C48657-013,RES,2K,1%,0.05W,TK2,GENERIC; CDS_LMAN_SYM_OUTLINE: -50,50,50,-50; FP_TECH: TK2; IP: GENERIC; ROOM: NONE; OriginalSymbolOrigin: (-25,75); XY: (4200,3350); VER: 2; SUB_ROOM: GPU_VCCIN; ROT: 0; PHYS_PAGE: 169; LOCATION: R3; DRAWING: @RVP1_ADL_SB_ADP_S_DDR5_SODIMM_2DPC_LIB.H55_DG2_2DPC(SCH_1):PAGE538; CDS_LIB: c_discrete; VARIANT: ?; PCB Footprint: CTK2_SM0201_650X350_MA; CHIPS_PART_NAME: C_RES; CDS_PART_NAME: C_RES_0201-C48657-013,RES,2K,1%,0.05W,TK2,GENERIC; CDS_LOCATION: R3
R55 = C_RES: CDS_PHYS_PART_NAME: C_RES_0201-C48657-010,RES,1K,1%,0.05W,TK0,GENERIC; CDS_LMAN_SYM_OUTLINE: -50,50,50,-50; FP_TECH: TK0; IP: GENERIC; ROOM: NONE; OriginalSymbolOrigin: (-25,75); XY: (2600,2825); VER: 2; SUB_ROOM: GPU_VCCIN; ROT: 0; PHYS_PAGE: 169; LOCATION: R55; DRAWING: @RVP1_ADL_SB_ADP_S_DDR5_SODIMM_2DPC_LIB.H55_DG2_2DPC(SCH_1):PAGE538; CDS_LIB: c_discrete; VARIANT: ?; PCB Footprint: CTK0_SM0201_630X330_MA; CHIPS_PART_NAME: C_RES; CDS_PART_NAME: C_RES_0201-C48657-010,RES,1K,1%,0.05W,TK0,GENERIC; CDS_LOCATION: R55
R57 = C_RES: CDS_PHYS_PART_NAME: C_RES_0201-C48657-013,RES,2K,1%,0.05W,TK2,GENERIC; CDS_LMAN_SYM_OUTLINE: -50,50,50,-50; FP_TECH: TK2; IP: GENERIC; ROOM: NONE; OriginalSymbolOrigin: (-25,75); XY: (3625,3325); VER: 2; SUB_ROOM: GPU_VCCIN; ROT: 0; PHYS_PAGE: 169; LOCATION: R57; DRAWING: @RVP1_ADL_SB_ADP_S_DDR5_SODIMM_2DPC_LIB.H55_DG2_2DPC(SCH_1):PAGE538; CDS_LIB: c_discrete; VARIANT: ?; PCB Footprint: CTK2_SM0201_650X350_MA; CHIPS_PART_NAME: C_RES; CDS_PART_NAME: C_RES_0201-C48657-013,RES,2K,1%,0.05W,TK2,GENERIC; CDS_LOCATION: R57
R104 = C_RES: CDS_PHYS_PART_NAME: C_RES_0201-C48657-013,RES,2K,1%,0.05W,TK2,GENERIC; CDS_LMAN_SYM_OUTLINE: -50,50,50,-50; FP_TECH: TK2; IP: GENERIC; ROOM: NONE; OriginalSymbolOrigin: (-25,75); XY: (3925,3325); VER: 2; SUB_ROOM: GPU_VCCIN; ROT: 0; PHYS_PAGE: 169; LOCATION: R104; DRAWING: @RVP1_ADL_SB_ADP_S_DDR5_SODIMM_2DPC_LIB.H55_DG2_2DPC(SCH_1):PAGE538; CDS_LIB: c_discrete; VARIANT: ?; PCB Footprint: CTK2_SM0201_650X350_MA; CHIPS_PART_NAME: C_RES; CDS_PART_NAME: C_RES_0201-C48657-013,RES,2K,1%,0.05W,TK2,GENERIC; CDS_LOCATION: R104
R149 = C_RES#1: CHIPS_PART_NAME: C_RES; CDS_PHYS_PART_NAME: C_RES_0201-C48657-254,EMPTY,1.5K,1%,0.05W,TK0,GENERIC; CDS_LMAN_SYM_OUTLINE: -50,50,50,-50; FP_TECH: TK0; IP: GENERIC; ROOM: NONE; OriginalSymbolOrigin: (-75,25); XY: (-2325,1100); VER: 1; ROT: 0; PHYS_PAGE: 169; LOCATION: R149; DRAWING: @RVP1_ADL_SB_ADP_S_DDR5_SODIMM_2DPC_LIB.H55_DG2_2DPC(SCH_1):PAGE538; CDS_LIB: c_discrete; VARIANT: ?; PCB Footprint: CTK0_SM0201_630X330_MA; CDS_PART_NAME: C_RES_0201-C48657-254,EMPTY,1.5K,1%,0.05W,TK0,GENERIC; CDS_LOCATION: R149
R150 = C_RES#1: CHIPS_PART_NAME: C_RES; CDS_PHYS_PART_NAME: C_RES_0201-C48657-368,EMPTY,1K,1%,0.05W,TK0,GENERIC; CDS_LMAN_SYM_OUTLINE: -50,50,50,-50; FP_TECH: TK0; IP: GENERIC; ROOM: NONE; OriginalSymbolOrigin: (-75,25); XY: (-2325,450); VER: 1; ROT: 0; PHYS_PAGE: 169; LOCATION: R150; DRAWING: @RVP1_ADL_SB_ADP_S_DDR5_SODIMM_2DPC_LIB.H55_DG2_2DPC(SCH_1):PAGE538; CDS_LIB: c_discrete; VARIANT: ?; PCB Footprint: CTK0_SM0201_630X330_MA; CDS_PART_NAME: C_RES_0201-C48657-368,EMPTY,1K,1%,0.05W,TK0,GENERIC; CDS_LOCATION: R150
R151 = C_RES: CDS_PHYS_PART_NAME: C_RES_0402-A93549-027,EMPTY,100K,5%,0.0625W,TK0,GENERIC; CDS_LMAN_SYM_OUTLINE: -50,50,50,-50; FP_TECH: TK0; IP: GENERIC; ROOM: NONE; OriginalSymbolOrigin: (-25,75); XY: (-3075,3850); VER: 2; SUB_ROOM: GPU_VCCIN; ROT: 0; PHYS_PAGE: 169; LOCATION: R151; DRAWING: @RVP1_ADL_SB_ADP_S_DDR5_SODIMM_2DPC_LIB.H55_DG2_2DPC(SCH_1):PAGE538; CDS_LIB: c_discrete; VARIANT: ?; PCB Footprint: CTK0_SM0402_1100X550_MA; CHIPS_PART_NAME: C_RES; CDS_PART_NAME: C_RES_0402-A93549-027,EMPTY,100K,5%,0.0625W,TK0,GENERIC; CDS_LOCATION: R151
R152 = C_RES#1: CHIPS_PART_NAME: C_RES; CDS_PHYS_PART_NAME: C_RES_0201-J68654-001,RES,1.6K,1%,0.05W,TK2,GENERIC; CDS_LMAN_SYM_OUTLINE: -50,50,50,-50; FP_TECH: TK2; IP: GENERIC; ROOM: NONE; OriginalSymbolOrigin: (-75,25); XY: (-1875,1100); VER: 1; ROT: 0; PHYS_PAGE: 169; LOCATION: R152; DRAWING: @RVP1_ADL_SB_ADP_S_DDR5_SODIMM_2DPC_LIB.H55_DG2_2DPC(SCH_1):PAGE538; CDS_LIB: c_discrete; VARIANT: ?; PCB Footprint: CTK2_SM0201_630X330_MA; CDS_PART_NAME: C_RES_0201-J68654-001,RES,1.6K,1%,0.05W,TK2,GENERIC; CDS_LOCATION: R152
R153 = C_RES#1: CHIPS_PART_NAME: C_RES; CDS_PHYS_PART_NAME: C_RES_0402-A93548-337,RES,1.33K,1%,0.0625W,TK2,GENERIC; CDS_LMAN_SYM_OUTLINE: -50,50,50,-50; FP_TECH: TK2; IP: GENERIC; ROOM: NONE; OriginalSymbolOrigin: (-75,25); XY: (-1750,450); VER: 1; ROT: 0; PHYS_PAGE: 169; LOCATION: R153; DRAWING: @RVP1_ADL_SB_ADP_S_DDR5_SODIMM_2DPC_LIB.H55_DG2_2DPC(SCH_1):PAGE538; CDS_LIB: c_discrete; VARIANT: ?; PCB Footprint: CTK2_SM0402_1100X550_MA; CDS_PART_NAME: C_RES_0402-A93548-337,RES,1.33K,1%,0.0625W,TK2,GENERIC; CDS_LOCATION: R153
R155 = C_RES: CDS_PHYS_PART_NAME: C_RES_0402-A93548-168,RES,16.5K,1%,0.0625W,TK2,GENERIC; CDS_LMAN_SYM_OUTLINE: -50,50,50,-50; FP_TECH: TK2; IP: GENERIC; ROOM: NONE; OriginalSymbolOrigin: (-25,75); XY: (-1100,1925); VER: 2; ROT: 0; PHYS_PAGE: 169; LOCATION: R155; DRAWING: @RVP1_ADL_SB_ADP_S_DDR5_SODIMM_2DPC_LIB.H55_DG2_2DPC(SCH_1):PAGE538; CDS_LIB: c_discrete; VARIANT: ?; PCB Footprint: CTK2_SM0402_1100X550_MA; CHIPS_PART_NAME: C_RES; CDS_PART_NAME: C_RES_0402-A93548-168,RES,16.5K,1%,0.0625W,TK2,GENERIC; CDS_LOCATION: R155
R157 = C_RES: CDS_PHYS_PART_NAME: C_RES_0201-C48657-267,RES,2M,1%,0.05W,TK0,GENERIC; CDS_LMAN_SYM_OUTLINE: -50,50,50,-50; FP_TECH: TK0; IP: GENERIC; ROOM: NONE; OriginalSymbolOrigin: (-25,75); XY: (-975,925); VER: 2; ROT: 0; PHYS_PAGE: 169; LOCATION: R157; DRAWING: @RVP1_ADL_SB_ADP_S_DDR5_SODIMM_2DPC_LIB.H55_DG2_2DPC(SCH_1):PAGE538; CDS_LIB: c_discrete; VARIANT: ?; PCB Footprint: CTK0_SM0201_630X330_MA; CHIPS_PART_NAME: C_RES; CDS_PART_NAME: C_RES_0201-C48657-267,RES,2M,1%,0.05W,TK0,GENERIC; CDS_LOCATION: R157
R159 = C_RES: CDS_PHYS_PART_NAME: C_RES_0201-C48657-292,RES,133K,1%,0.05W,TK0,GENERIC; CDS_LMAN_SYM_OUTLINE: -50,50,50,-50; FP_TECH: TK0; IP: GENERIC; ROOM: NONE; OriginalSymbolOrigin: (-25,75); XY: (-575,500); VER: 2; ROT: 0; PHYS_PAGE: 169; LOCATION: R159; DRAWING: @RVP1_ADL_SB_ADP_S_DDR5_SODIMM_2DPC_LIB.H55_DG2_2DPC(SCH_1):PAGE538; CDS_LIB: c_discrete; VARIANT: ?; PCB Footprint: CTK0_SM0201_630X330_MA; CHIPS_PART_NAME: C_RES; CDS_PART_NAME: C_RES_0201-C48657-292,RES,133K,1%,0.05W,TK0,GENERIC; CDS_LOCATION: R159
R169 = C_RES#1: CHIPS_PART_NAME: C_RES; CDS_PHYS_PART_NAME: C_RES_0201-C80792-009,RES,0,5%,0.05W,TK2,GENERIC; CDS_LMAN_SYM_OUTLINE: -50,50,50,-50; FP_TECH: TK2; IP: GENERIC; ROOM: NONE; OriginalSymbolOrigin: (-75,25); XY: (2950,2425); VER: 1; PHYS_PAGE: 169; LOCATION: R169; DRAWING: @RVP1_ADL_SB_ADP_S_DDR5_SODIMM_2DPC_LIB.H55_DG2_2DPC(SCH_1):PAGE538; CDS_LIB: c_discrete; VARIANT: ?; PCB Footprint: CTK2_SM0201_630X330_MA; ROT: 0; CDS_PART_NAME: C_RES_0201-C80792-009,RES,0,5%,0.05W,TK2,GENERIC; CDS_LOCATION: R169
R170 = C_RES#1: CHIPS_PART_NAME: C_RES; CDS_PHYS_PART_NAME: C_RES_0201-C48657-048,RES,80.6K,1%,0.05W,TK2,GENERIC; CDS_LMAN_SYM_OUTLINE: -50,50,50,-50; FP_TECH: TK2; IP: GENERIC; ROOM: NONE; OriginalSymbolOrigin: (-75,25); XY: (2900,1150); VER: 1; ROT: 0; PHYS_PAGE: 169; LOCATION: R170; DRAWING: @RVP1_ADL_SB_ADP_S_DDR5_SODIMM_2DPC_LIB.H55_DG2_2DPC(SCH_1):PAGE538; CDS_LIB: c_discrete; VARIANT: ?; PCB Footprint: CTK2_SM0201_630X330_MA; CDS_PART_NAME: C_RES_0201-C48657-048,RES,80.6K,1%,0.05W,TK2,GENERIC; CDS_LOCATION: R170
R171 = RES#1: CHIPS_PART_NAME: RES; CDS_PHYS_PART_NAME: RES_0402-A93548-234,CHIP,118K,1%,1/16W,LPDB,GENERIC; OriginalSymbolOrigin: (-75,25); XY: (2925,475); VER: 1; ROT: 0; PHYS_PAGE: 169; LOCATION: R171; IP: GENERIC; FP_TECH: LPDB; DRAWING: @RVP1_ADL_SB_ADP_S_DDR5_SODIMM_2DPC_LIB.H55_DG2_2DPC(SCH_1):PAGE538; CDS_LIB: discrete; PCB Footprint: SMR0402IA; CDS_PART_NAME: RES_0402-A93548-234,CHIP,118K,1%,1/16W,LPDB,GENERIC; CDS_LOCATION: R171
R172 = C_RES#1: CHIPS_PART_NAME: C_RES; CDS_PHYS_PART_NAME: C_RES_0201-M13119-001,RES,2.55K,1%,0.05W,TK2,GENERIC; CDS_LMAN_SYM_OUTLINE: -50,50,50,-50; FP_TECH: TK2; IP: GENERIC; ROOM: NONE; OriginalSymbolOrigin: (-75,25); XY: (2900,1800); VER: 1; ROT: 0; PHYS_PAGE: 169; LOCATION: R172; DRAWING: @RVP1_ADL_SB_ADP_S_DDR5_SODIMM_2DPC_LIB.H55_DG2_2DPC(SCH_1):PAGE538; CDS_LIB: c_discrete; VARIANT: ?; PCB Footprint: CTK2_SM0201_650X350_MA; CDS_PART_NAME: C_RES_0201-M13119-001,RES,2.55K,1%,0.05W,TK2,GENERIC; CDS_LOCATION: R172
R173 = C_RES#1: CHIPS_PART_NAME: C_RES; CDS_PHYS_PART_NAME: C_RES_0201-C80792-009,RES,0,5%,0.05W,TK2,GENERIC; CDS_LMAN_SYM_OUTLINE: -50,50,50,-50; FP_TECH: TK2; IP: GENERIC; ROOM: NONE; OriginalSymbolOrigin: (-75,25); XY: (3525,2475); VER: 1; PHYS_PAGE: 169; LOCATION: R173; DRAWING: @RVP1_ADL_SB_ADP_S_DDR5_SODIMM_2DPC_LIB.H55_DG2_2DPC(SCH_1):PAGE538; CDS_LIB: c_discrete; VARIANT: ?; PCB Footprint: CTK2_SM0201_630X330_MA; ROT: 0; CDS_PART_NAME: C_RES_0201-C80792-009,RES,0,5%,0.05W,TK2,GENERIC; CDS_LOCATION: R173
R174 = C_RES#1: CHIPS_PART_NAME: C_RES; CDS_PHYS_PART_NAME: C_RES_0201-C48657-027,RES,0,1%,0.05W,TK2,GENERIC; CDS_LMAN_SYM_OUTLINE: -50,50,50,-50; FP_TECH: TK2; IP: GENERIC; ROOM: NONE; OriginalSymbolOrigin: (-75,25); XY: (3725,1150); VER: 1; PHYS_PAGE: 169; LOCATION: R174; DRAWING: @RVP1_ADL_SB_ADP_S_DDR5_SODIMM_2DPC_LIB.H55_DG2_2DPC(SCH_1):PAGE538; CDS_LIB: c_discrete; VARIANT: ?; PCB Footprint: CTK2_SM0201_630X330_MA; ROT: 0; CDS_PART_NAME: C_RES_0201-C48657-027,RES,0,1%,0.05W,TK2,GENERIC; CDS_LOCATION: R174
R175 = C_RES#1: CHIPS_PART_NAME: C_RES; CDS_PHYS_PART_NAME: C_RES_0201-C48657-114,RES,69.8K,1%,0.05W,TK2,GENERIC; CDS_LMAN_SYM_OUTLINE: -50,50,50,-50; FP_TECH: TK2; IP: GENERIC; ROOM: NONE; OriginalSymbolOrigin: (-75,25); XY: (3700,475); VER: 1; ROT: 0; PHYS_PAGE: 169; LOCATION: R175; DRAWING: @RVP1_ADL_SB_ADP_S_DDR5_SODIMM_2DPC_LIB.H55_DG2_2DPC(SCH_1):PAGE538; CDS_LIB: c_discrete; VARIANT: ?; PCB Footprint: CTK2_SM0201_630X330_MA; CDS_PART_NAME: C_RES_0201-C48657-114,RES,69.8K,1%,0.05W,TK2,GENERIC; CDS_LOCATION: R175
R176 = C_RES#1: CHIPS_PART_NAME: C_RES; CDS_PHYS_PART_NAME: C_RES_0201-C48657-065,RES,24.9K,1%,0.05W,TK2,GENERIC; CDS_LMAN_SYM_OUTLINE: -50,50,50,-50; FP_TECH: TK2; IP: GENERIC; ROOM: NONE; OriginalSymbolOrigin: (-75,25); XY: (3675,1800); VER: 1; ROT: 0; PHYS_PAGE: 169; LOCATION: R176; DRAWING: @RVP1_ADL_SB_ADP_S_DDR5_SODIMM_2DPC_LIB.H55_DG2_2DPC(SCH_1):PAGE538; CDS_LIB: c_discrete; VARIANT: ?; PCB Footprint: CTK2_SM0201_630X330_MA; CDS_PART_NAME: C_RES_0201-C48657-065,RES,24.9K,1%,0.05W,TK2,GENERIC; CDS_LOCATION: R176
R446 = C_RES: CDS_PHYS_PART_NAME: C_RES_0402-A93549-059,RES,4.7,5%,0.0625W,TK0,GENERIC; CDS_LMAN_SYM_OUTLINE: -50,50,50,-50; FP_TECH: TK0; IP: GENERIC; ROOM: NONE; OriginalSymbolOrigin: (-25,75); XY: (-700,4050); VER: 2; ROT: 0; PHYS_PAGE: 169; LOCATION: R446; DRAWING: @RVP1_ADL_SB_ADP_S_DDR5_SODIMM_2DPC_LIB.H55_DG2_2DPC(SCH_1):PAGE538; CDS_LIB: c_discrete; VARIANT: ?; PCB Footprint: CTK0_SM0402_1100X550_MA; SEC_TYPE: 0402; CHIPS_PART_NAME: C_RES; CDS_PART_NAME: C_RES_0402-A93549-059,RES,4.7,5%,0.0625W,TK0,GENERIC; CDS_LOCATION: R446
R1195 = RES#1: PART_NUMBER: A93548-003; CHIPS_PART_NAME: RES; CDS_PHYS_PART_NAME: RES_0402-A93548-003,CHIP,75,1%,1/16W,LPDB,GENERIC; OriginalSymbolOrigin: (-75,25); XY: (1800,2275); VER: 1; ROT: 0; PHYS_PAGE: 169; LOCATION: R1195; IP: GENERIC; FP_TECH: LPDB; DRAWING: @RVP1_ADL_SB_ADP_S_DDR5_SODIMM_2DPC_LIB.H55_DG2_2DPC(SCH_1):PAGE538; CDS_LIB: discrete; PCB Footprint: SMR0402IA; CDS_PART_NAME: RES_0402-A93548-003,CHIP,75,1%,1/16W,LPDB,GENERIC; CDS_LOCATION: R1195
R1283 = C_RES: CDS_PHYS_PART_NAME: C_RES_0201-C80792-009,EMPTY,0,5%,0.05W,TK0,GENERIC; CDS_LMAN_SYM_OUTLINE: -50,50,50,-50; FP_TECH: TK0; IP: GENERIC; ROOM: NONE; OriginalSymbolOrigin: (-25,75); XY: (675,400); VER: 2; SUB_ROOM: GPU_VCCIN; PHYS_PAGE: 169; LOCATION: R1283; DRAWING: @RVP1_ADL_SB_ADP_S_DDR5_SODIMM_2DPC_LIB.H55_DG2_2DPC(SCH_1):PAGE538; CDS_LIB: c_discrete; VARIANT: ?; PCB Footprint: CTK0_SM0201_630X330_MA; ROT: 0; CHIPS_PART_NAME: C_RES; CDS_PART_NAME: C_RES_0201-C80792-009,EMPTY,0,5%,0.05W,TK0,GENERIC; CDS_LOCATION: R1283
R1285 = C_RES: CDS_PHYS_PART_NAME: C_RES_0201-C48657-079,RES,49.9K,1%,0.05W,TK2,GENERIC; CDS_LMAN_SYM_OUTLINE: -50,50,50,-50; FP_TECH: TK2; IP: GENERIC; ROOM: NONE; OriginalSymbolOrigin: (-25,75); XY: (1750,550); VER: 2; ROT: 0; PHYS_PAGE: 169; LOCATION: R1285; DRAWING: @RVP1_ADL_SB_ADP_S_DDR5_SODIMM_2DPC_LIB.H55_DG2_2DPC(SCH_1):PAGE538; CDS_LIB: c_discrete; VARIANT: ?; PCB Footprint: CTK2_SM0201_650X350_MA; CHIPS_PART_NAME: C_RES; CDS_PART_NAME: C_RES_0201-C48657-079,RES,49.9K,1%,0.05W,TK2,GENERIC; CDS_LOCATION: R1285
R1287 = C_RES: CDS_PHYS_PART_NAME: C_RES_0201-C48657-057,RES,100K,1%,0.05W,TK0,GENERIC; CDS_LMAN_SYM_OUTLINE: -50,50,50,-50; FP_TECH: TK0; IP: GENERIC; ROOM: NONE; OriginalSymbolOrigin: (-25,75); XY: (675,800); VER: 2; SUB_ROOM: GPU_VCCIN; ROT: 0; PHYS_PAGE: 169; LOCATION: R1287; DRAWING: @RVP1_ADL_SB_ADP_S_DDR5_SODIMM_2DPC_LIB.H55_DG2_2DPC(SCH_1):PAGE538; CDS_LIB: c_discrete; VARIANT: ?; PCB Footprint: CTK0_SM0201_630X330_MA; CHIPS_PART_NAME: C_RES; CDS_PART_NAME: C_RES_0201-C48657-057,RES,100K,1%,0.05W,TK0,GENERIC; CDS_LOCATION: R1287
R1289 = C_RES: CDS_PHYS_PART_NAME: C_RES_0201-C80792-009,RES,0,5%,0.05W,TK2,GENERIC; CDS_LMAN_SYM_OUTLINE: -50,50,50,-50; FP_TECH: TK2; IP: GENERIC; ROOM: NONE; OriginalSymbolOrigin: (-25,75); XY: (1750,925); VER: 2; SUB_ROOM: GPU_VCCIN; PHYS_PAGE: 169; LOCATION: R1289; DRAWING: @RVP1_ADL_SB_ADP_S_DDR5_SODIMM_2DPC_LIB.H55_DG2_2DPC(SCH_1):PAGE538; CDS_LIB: c_discrete; VARIANT: ?; PCB Footprint: CTK2_SM0201_630X330_MA; ROT: 0; CHIPS_PART_NAME: C_RES; CDS_PART_NAME: C_RES_0201-C80792-009,RES,0,5%,0.05W,TK2,GENERIC; CDS_LOCATION: R1289
R1451 = C_RES#1: CHIPS_PART_NAME: C_RES; CDS_PHYS_PART_NAME: C_RES_0402-A93549-001,RES,0,5%,0.0625W,TK0,GENERIC; CDS_LMAN_SYM_OUTLINE: -50,50,50,-50; FP_TECH: TK0; IP: GENERIC; ROOM: NONE; OriginalSymbolOrigin: (-75,25); XY: (-1175,3075); VER: 1; PHYS_PAGE: 169; LOCATION: R1451; DRAWING: @RVP1_ADL_SB_ADP_S_DDR5_SODIMM_2DPC_LIB.H55_DG2_2DPC(SCH_1):PAGE538; CDS_LIB: c_discrete; VARIANT: ?; PCB Footprint: CTK0_SM0402_1100X550_MA; ROT: 0; CDS_PART_NAME: C_RES_0402-A93549-001,RES,0,5%,0.0625W,TK0,GENERIC; CDS_LOCATION: R1451
R12458 = C_RES#1: PART_NUMBER: A93549-001; CHIPS_PART_NAME: C_RES; CDS_PHYS_PART_NAME: C_RES_0402-A93549-001,RES,0,5%,0.0625W,TK0,GENERIC; CDS_LMAN_SYM_OUTLINE: -50,50,50,-50; FP_TECH: TK0; IP: GENERIC; ROOM: NONE; WATTAGE: 0.0625W; OriginalSymbolOrigin: (-75,25); XY: (-2125,3125); VER: 1; PHYS_PAGE: 169; LOCATION: R12458; DRAWING: @RVP1_ADL_SB_ADP_S_DDR5_SODIMM_2DPC_LIB.H55_DG2_2DPC(SCH_1):PAGE538; CDS_LIB: c_discrete; VARIANT: ?; PCB Footprint: CTK0_SM0402_1100X550_MA; ROT: 0; CDS_PART_NAME: C_RES_0402-A93549-001,RES,0,5%,0.0625W,TK0,GENERIC; CDS_LOCATION: R12458
R17001 = C_RES: CDS_PHYS_PART_NAME: C_RES_0201-C48657-013,RES,2K,1%,0.05W,TK2,GENERIC; CDS_LMAN_SYM_OUTLINE: -50,50,50,-50; FP_TECH: TK2; IP: GENERIC; ROOM: NONE; OriginalSymbolOrigin: (-25,75); XY: (3300,3325); VER: 2; SUB_ROOM: GPU_VCCIN; ROT: 0; PHYS_PAGE: 169; LOCATION: R17001; DRAWING: @RVP1_ADL_SB_ADP_S_DDR5_SODIMM_2DPC_LIB.H55_DG2_2DPC(SCH_1):PAGE538; CDS_LIB: c_discrete; VARIANT: ?; PCB Footprint: CTK2_SM0201_650X350_MA; CHIPS_PART_NAME: C_RES; CDS_PART_NAME: C_RES_0201-C48657-013,RES,2K,1%,0.05W,TK2,GENERIC; CDS_LOCATION: R17001
R17002 = C_RES#1: PART_NUMBER: A93548-031; CHIPS_PART_NAME: C_RES; CDS_PHYS_PART_NAME: C_RES_0402-A93548-031,RES,10,1%,0.0625W,TK2,GENERIC; CDS_LMAN_SYM_OUTLINE: -50,50,50,-50; FP_TECH: TK2; IP: GENERIC; ROOM: NONE; WATTAGE: 0.0625W; OriginalSymbolOrigin: (-75,25); XY: (-1425,3275); VER: 1; ROT: 0; PHYS_PAGE: 169; LOCATION: R17002; DRAWING: @RVP1_ADL_SB_ADP_S_DDR5_SODIMM_2DPC_LIB.H55_DG2_2DPC(SCH_1):PAGE538; CDS_LIB: c_discrete; VARIANT: ?; PCB Footprint: CTK2_SM0402_1100X550_MA; CDS_PART_NAME: C_RES_0402-A93548-031,RES,10,1%,0.0625W,TK2,GENERIC; CDS_LOCATION: R17002
R17003 = C_RES#1: PART_NUMBER: A93549-001; CHIPS_PART_NAME: C_RES; CDS_PHYS_PART_NAME: C_RES_0402-A93549-001,RES,0,5%,0.0625W,TK0,GENERIC; CDS_LMAN_SYM_OUTLINE: -50,50,50,-50; FP_TECH: TK0; IP: GENERIC; ROOM: NONE; WATTAGE: 0.0625W; OriginalSymbolOrigin: (-75,25); XY: (-1400,3475); VER: 1; PHYS_PAGE: 169; LOCATION: R17003; DRAWING: @RVP1_ADL_SB_ADP_S_DDR5_SODIMM_2DPC_LIB.H55_DG2_2DPC(SCH_1):PAGE538; CDS_LIB: c_discrete; VARIANT: ?; PCB Footprint: CTK0_SM0402_1100X550_MA; ROT: 0; CDS_PART_NAME: C_RES_0402-A93549-001,RES,0,5%,0.0625W,TK0,GENERIC; CDS_LOCATION: R17003
R17004 = C_RES#1: PART_NUMBER: A93549-001; CHIPS_PART_NAME: C_RES; CDS_PHYS_PART_NAME: C_RES_0402-A93549-001,RES,0,5%,0.0625W,TK0,GENERIC; CDS_LMAN_SYM_OUTLINE: -50,50,50,-50; FP_TECH: TK0; IP: GENERIC; ROOM: NONE; WATTAGE: 0.0625W; OriginalSymbolOrigin: (-75,25); XY: (-1400,3425); VER: 1; PHYS_PAGE: 169; LOCATION: R17004; DRAWING: @RVP1_ADL_SB_ADP_S_DDR5_SODIMM_2DPC_LIB.H55_DG2_2DPC(SCH_1):PAGE538; CDS_LIB: c_discrete; VARIANT: ?; PCB Footprint: CTK0_SM0402_1100X550_MA; ROT: 0; CDS_PART_NAME: C_RES_0402-A93549-001,RES,0,5%,0.0625W,TK0,GENERIC; CDS_LOCATION: R17004
R17005 = C_RES#1: PART_NUMBER: A93548-045; CHIPS_PART_NAME: C_RES; CDS_PHYS_PART_NAME: C_RES_0402-A93548-045,RES,49.9,1%,0.0625W,TK2,GENERIC; CDS_LMAN_SYM_OUTLINE: -50,50,50,-50; FP_TECH: TK2; IP: GENERIC; ROOM: NONE; WATTAGE: 0.0625W; OriginalSymbolOrigin: (-75,25); XY: (-950,3325); VER: 1; ROT: 0; PHYS_PAGE: 169; LOCATION: R17005; DRAWING: @RVP1_ADL_SB_ADP_S_DDR5_SODIMM_2DPC_LIB.H55_DG2_2DPC(SCH_1):PAGE538; CDS_LIB: c_discrete; VARIANT: ?; PCB Footprint: CTK2_SM0402_1100X550_MA; CDS_PART_NAME: C_RES_0402-A93548-045,RES,49.9,1%,0.0625W,TK2,GENERIC; CDS_LOCATION: R17005
R17006 = C_RES#1: PART_NUMBER: A93549-001; CHIPS_PART_NAME: C_RES; CDS_PHYS_PART_NAME: C_RES_0402-A93549-001,RES,0,5%,0.0625W,TK0,GENERIC; CDS_LMAN_SYM_OUTLINE: -50,50,50,-50; FP_TECH: TK0; IP: GENERIC; ROOM: NONE; WATTAGE: 0.0625W; OriginalSymbolOrigin: (-75,25); XY: (-625,3225); VER: 1; PHYS_PAGE: 169; LOCATION: R17006; DRAWING: @RVP1_ADL_SB_ADP_S_DDR5_SODIMM_2DPC_LIB.H55_DG2_2DPC(SCH_1):PAGE538; CDS_LIB: c_discrete; VARIANT: ?; PCB Footprint: CTK0_SM0402_1100X550_MA; ROT: 0; CDS_PART_NAME: C_RES_0402-A93549-001,RES,0,5%,0.0625W,TK0,GENERIC; CDS_LOCATION: R17006
R17007 = C_RES: CDS_PHYS_PART_NAME: C_RES_0201-C48657-013,RES,2K,1%,0.05W,TK2,GENERIC; CDS_LMAN_SYM_OUTLINE: -50,50,50,-50; FP_TECH: TK2; IP: GENERIC; ROOM: NONE; OriginalSymbolOrigin: (-25,75); XY: (2900,3300); VER: 2; SUB_ROOM: GPU_VCCIN; ROT: 0; PHYS_PAGE: 169; LOCATION: R17007; DRAWING: @RVP1_ADL_SB_ADP_S_DDR5_SODIMM_2DPC_LIB.H55_DG2_2DPC(SCH_1):PAGE538; CDS_LIB: c_discrete; VARIANT: ?; PCB Footprint: CTK2_SM0201_650X350_MA; CHIPS_PART_NAME: C_RES; CDS_PART_NAME: C_RES_0201-C48657-013,RES,2K,1%,0.05W,TK2,GENERIC; CDS_LOCATION: R17007
R17008 = C_RES: CDS_PHYS_PART_NAME: C_RES_0201-C48657-013,RES,2K,1%,0.05W,TK2,GENERIC; CDS_LMAN_SYM_OUTLINE: -50,50,50,-50; FP_TECH: TK2; IP: GENERIC; ROOM: NONE; OriginalSymbolOrigin: (-25,75); XY: (3125,3300); VER: 2; SUB_ROOM: GPU_VCCIN; ROT: 0; PHYS_PAGE: 169; LOCATION: R17008; DRAWING: @RVP1_ADL_SB_ADP_S_DDR5_SODIMM_2DPC_LIB.H55_DG2_2DPC(SCH_1):PAGE538; CDS_LIB: c_discrete; VARIANT: ?; PCB Footprint: CTK2_SM0201_650X350_MA; CHIPS_PART_NAME: C_RES; CDS_PART_NAME: C_RES_0201-C48657-013,RES,2K,1%,0.05W,TK2,GENERIC; CDS_LOCATION: R17008
R17009 = C_RES#1: PART_NUMBER: A93549-001; CHIPS_PART_NAME: C_RES; CDS_PHYS_PART_NAME: C_RES_0402-A93549-001,EMPTY,0,5%,0.0625W,TK0,GENERIC; CDS_LMAN_SYM_OUTLINE: -50,50,50,-50; FP_TECH: TK0; IP: GENERIC; ROOM: NONE; WATTAGE: 0.0625W; OriginalSymbolOrigin: (-75,25); XY: (-2100,3600); VER: 1; PHYS_PAGE: 169; LOCATION: R17009; DRAWING: @RVP1_ADL_SB_ADP_S_DDR5_SODIMM_2DPC_LIB.H55_DG2_2DPC(SCH_1):PAGE538; CDS_LIB: c_discrete; VARIANT: ?; PCB Footprint: CTK0_SM0402_1100X550_MA; ROT: 0; CDS_PART_NAME: C_RES_0402-A93549-001,EMPTY,0,5%,0.0625W,TK0,GENERIC; CDS_LOCATION: R17009; ASI_MODEL: A93549-001
R17010 = C_RES#1: PART_NUMBER: A93549-001; CHIPS_PART_NAME: C_RES; CDS_PHYS_PART_NAME: C_RES_0402-A93549-001,EMPTY,0,5%,0.0625W,TK0,GENERIC; CDS_LMAN_SYM_OUTLINE: -50,50,50,-50; FP_TECH: TK0; IP: GENERIC; ROOM: NONE; WATTAGE: 0.0625W; OriginalSymbolOrigin: (-75,25); XY: (-1875,3375); VER: 1; PHYS_PAGE: 169; LOCATION: R17010; DRAWING: @RVP1_ADL_SB_ADP_S_DDR5_SODIMM_2DPC_LIB.H55_DG2_2DPC(SCH_1):PAGE538; CDS_LIB: c_discrete; VARIANT: ?; PCB Footprint: CTK0_SM0402_1100X550_MA; ROT: 0; CDS_PART_NAME: C_RES_0402-A93549-001,EMPTY,0,5%,0.0625W,TK0,GENERIC; CDS_LOCATION: R17010; ASI_MODEL: A93549-001
R18212 = C_RES: CDS_PHYS_PART_NAME: C_RES_0402-A93549-027,RES,100K,5%,0.0625W,TK0,GENERIC; CDS_LMAN_SYM_OUTLINE: -50,50,50,-50; FP_TECH: TK0; IP: GENERIC; ROOM: NONE; OriginalSymbolOrigin: (-25,75); XY: (-3075,4300); VER: 2; ROT: 0; PHYS_PAGE: 169; LOCATION: R18212; DRAWING: @RVP1_ADL_SB_ADP_S_DDR5_SODIMM_2DPC_LIB.H55_DG2_2DPC(SCH_1):PAGE538; CDS_LIB: c_discrete; VARIANT: ?; PCB Footprint: CTK0_SM0402_1100X550_MA; CHIPS_PART_NAME: C_RES; CDS_PART_NAME: C_RES_0402-A93549-027,RES,100K,5%,0.0625W,TK0,GENERIC; CDS_LOCATION: R18212